# Altium project fMUX_MB.PrjPCB (part 3 of 6)

## Sheet DDR-Memory.SchDoc: FPGA Motherboard for Digital Multiplexed Readout, McGill U.
size B; DocumentNumber: DfMUX12; Revision: Rev0, Prototype; SheetNumber: 12; SheetTotal: 27; PageSetup: Record=PageOptions|CenterHorizontal=True|CenterVertical=True|PrintScale=1.08|XCorrection=1.00|YCorrection=1.00|PrintKind=0|BorderSize=5000000|LeftOffset=0|BottomOffset=0|Orientation=2|PaperLength=1000|PaperWidth=1000|Scale=100|PaperSource=7|PrintQuality=-4|MediaType=1|DitherType=10|PaperKind=Tabloid|PrintScaleMode=1
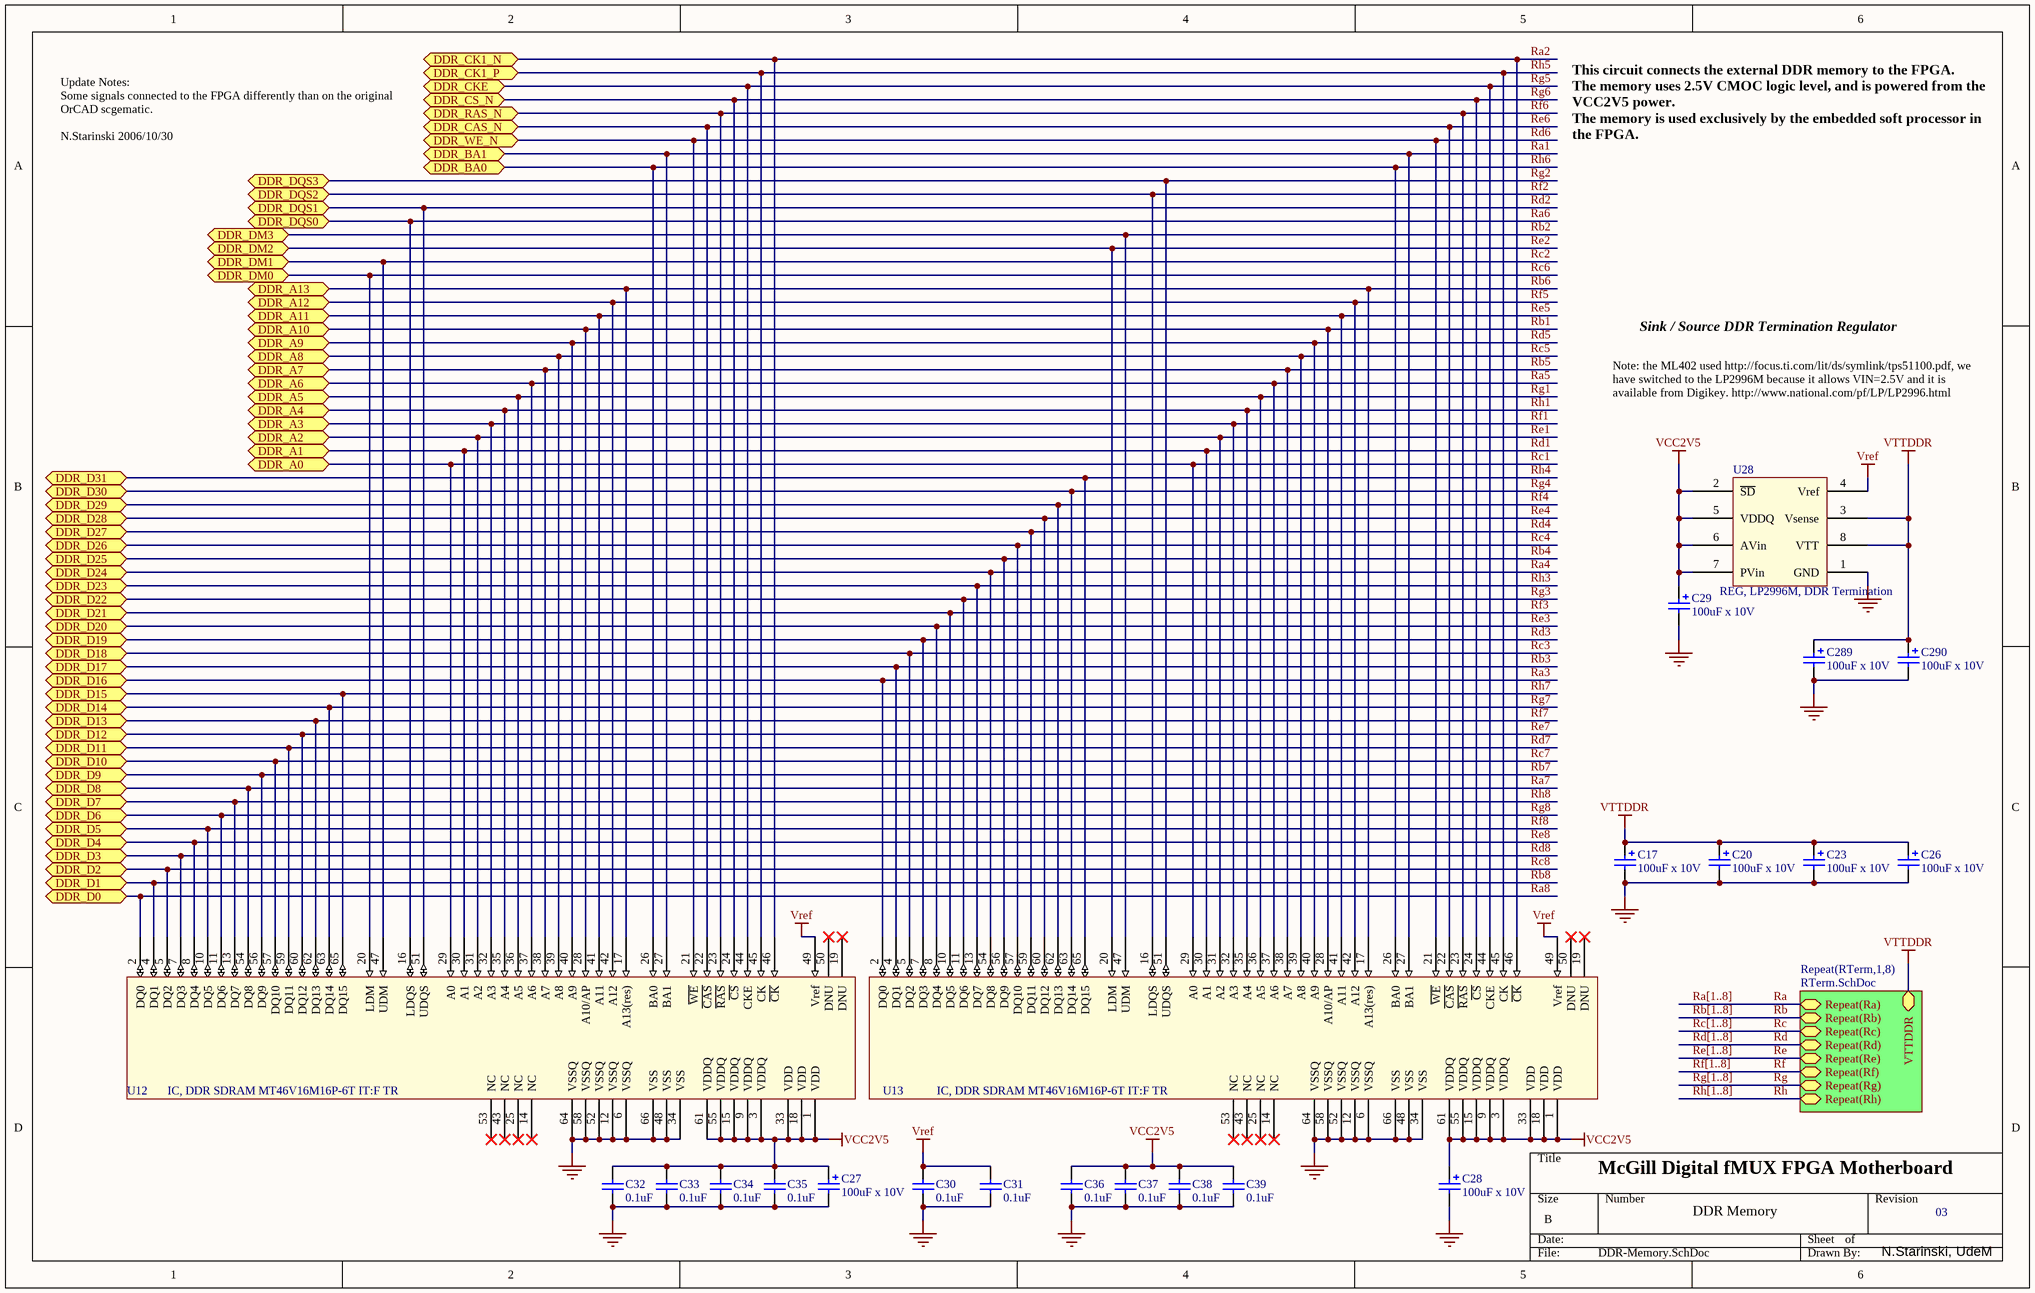
[diagram p13: DDR-Memory.SchDoc]

### Parts
C17  100uF x 10V  [TC6032-2412]
C20  100uF x 10V  [TC6032-2412]
C23  100uF x 10V  [TC6032-2412]
C26  100uF x 10V  [TC6032-2412]
C27  100uF x 10V  [TC6032-2412]
C28  100uF x 10V  [TC6032-2412]
C29  100uF x 10V  [TC6032-2412]
C30  0.1uF  [CC1608-0603]
C31  0.1uF  [CC1608-0603]
C32  0.1uF  [CC1608-0603]
C33  0.1uF  [CC1608-0603]
C34  0.1uF  [CC1608-0603]
C35  0.1uF  [CC1608-0603]
C36  0.1uF  [CC1608-0603]
C37  0.1uF  [CC1608-0603]
C38  0.1uF  [CC1608-0603]
C39  0.1uF  [CC1608-0603]
C289  100uF x 10V  [TC6032-2412]
C290  100uF x 10V  [TC6032-2412]
U12  IC, DDR SDRAM MT46V16M16P-6T IT:F TR  [TSOP-66]
U13  IC, DDR SDRAM MT46V16M16P-6T IT:F TR  [TSOP-66]
U28  REG, LP2996M, DDR Termination  [M08A]

### Sub-sheets
Repeat(RTerm,1,8) = RTerm.SchDoc: Repeat(Ra) (bidir), Repeat(Rb) (bidir), Repeat(Rc) (bidir), Repeat(Rd) (bidir), Repeat(Re) (bidir), Repeat(Rf) (bidir), Repeat(Rg) (bidir), Repeat(Rh) (bidir), VTTDDR (bidir)

### Ports
DDR_A0 (bidir), DDR_A1 (bidir), DDR_A2 (bidir), DDR_A3 (bidir), DDR_A4 (bidir), DDR_A5 (bidir), DDR_A6 (bidir), DDR_A7 (bidir), DDR_A8 (bidir), DDR_A9 (bidir), DDR_A10 (bidir), DDR_A11 (bidir), DDR_A12 (bidir), DDR_A13 (bidir), DDR_BA0 (bidir), DDR_BA1 (bidir), DDR_CAS_N (bidir), DDR_CK1_N (bidir), DDR_CK1_P (bidir), DDR_CKE (bidir), DDR_CS_N (bidir), DDR_D0 (bidir), DDR_D1 (bidir), DDR_D2 (bidir), DDR_D3 (bidir), DDR_D4 (bidir), DDR_D5 (bidir), DDR_D6 (bidir), DDR_D7 (bidir), DDR_D8 (bidir), DDR_D9 (bidir), DDR_D10 (bidir), DDR_D11 (bidir), DDR_D12 (bidir), DDR_D13 (bidir), DDR_D14 (bidir), DDR_D15 (bidir), DDR_D16 (bidir), DDR_D17 (bidir), DDR_D18 (bidir), DDR_D19 (bidir), DDR_D20 (bidir), DDR_D21 (bidir), DDR_D22 (bidir), DDR_D23 (bidir), DDR_D24 (bidir), DDR_D25 (bidir), DDR_D26 (bidir), DDR_D27 (bidir), DDR_D28 (bidir), DDR_D29 (bidir), DDR_D30 (bidir), DDR_D31 (bidir), DDR_DM0 (bidir), DDR_DM1 (bidir), DDR_DM2 (bidir), DDR_DM3 (bidir), DDR_DQS0 (bidir), DDR_DQS1 (bidir), DDR_DQS2 (bidir), DDR_DQS3 (bidir), DDR_RAS_N (bidir), DDR_WE_N (bidir)

### Nets
GND: C17.2 C20.2 C23.2 C26.2 C27.2 C28.2 C29.2 C30.1 C31.1 C32.1 C33.1 C34.1 C35.1 C36.1 C37.1 C38.1 C39.1 C289.2 C290.2 U12.6(VSSQ) U12.12(VSSQ) U12.34(VSS) U12.48(VSS) U12.52(VSSQ) U12.58(VSSQ) U12.64(VSSQ) U12.66(VSS) U13.6(VSSQ) U13.12(VSSQ) U13.34(VSS) U13.48(VSS) U13.52(VSSQ) U13.58(VSSQ) U13.64(VSSQ) U13.66(VSS) U28.1(GND)
VCC2V5: C27.1 C28.1 C29.1 C32.2 C33.2 C34.2 C35.2 C36.2 C37.2 C38.2 C39.2 U12.1(VDD) U12.3(VDDQ) U12.9(VDDQ) U12.15(VDDQ) U12.18(VDD) U12.33(VDD) U12.55(VDDQ) U12.61(VDDQ) U13.1(VDD) U13.3(VDDQ) U13.9(VDDQ) U13.15(VDDQ) U13.18(VDD) U13.33(VDD) U13.55(VDDQ) U13.61(VDDQ) U28.2(~{SD}) U28.5(VDDQ) U28.6(AVin) U28.7(PVin)  [project net Vout2]
Vref: C30.2 C31.2 U12.49(Vref) U13.49(Vref) U28.4(Vref)
VTTDDR: C17.1 C20.1 C23.1 C26.1 C289.1 C290.1 U28.3(Vsense) U28.8(VTT) ; sheet Repeat(RTerm,1,8)/VTTDDR
Ra: sheet Repeat(RTerm,1,8)/Repeat(Ra)
Ra1: U12.27(BA1) U13.27(BA1) ; port DDR_BA1  [project net DDR_BA1]
Ra2: U12.46(~{CK}) U13.46(~{CK}) ; port DDR_CK1_N  [project net DDR_CK1_N]
Ra3: U13.2(DQ0) ; port DDR_D16  [project net DDR_D16]
Ra4: U13.54(DQ8) ; port DDR_D24  [project net DDR_D24]
Ra5: U12.37(A6) U13.37(A6) ; port DDR_A6  [project net DDR_A6]
Ra6: U12.16(LDQS) ; port DDR_DQS0  [project net DDR_DQS0]
Ra7: U12.54(DQ8) ; port DDR_D8  [project net DDR_D8]
Ra8: U12.2(DQ0) ; port DDR_D0  [project net DDR_D0]
Rb: sheet Repeat(RTerm,1,8)/Repeat(Rb)
Rb1: U12.28(A10/AP) U13.28(A10/AP) ; port DDR_A10  [project net DDR_A10]
Rb2: U13.47(UDM) ; port DDR_DM3  [project net DDR_DM3]
Rb3: U13.4(DQ1) ; port DDR_D17  [project net DDR_D17]
Rb4: U13.56(DQ9) ; port DDR_D25  [project net DDR_D25]
Rb5: U12.38(A7) U13.38(A7) ; port DDR_A7  [project net DDR_A7]
Rb6: U12.17(A13(res)) U13.17(A13(res)) ; port DDR_A13  [project net DDR_A13]
Rb7: U12.56(DQ9) ; port DDR_D9  [project net DDR_D9]
Rb8: U12.4(DQ1) ; port DDR_D1  [project net DDR_D1]
Rc: sheet Repeat(RTerm,1,8)/Repeat(Rc)
Rc1: U12.29(A0) U13.29(A0) ; port DDR_A0  [project net DDR_A0]
Rc2: U12.47(UDM) ; port DDR_DM1  [project net DDR_DM1]
Rc3: U13.5(DQ2) ; port DDR_D18  [project net DDR_D18]
Rc4: U13.57(DQ10) ; port DDR_D26  [project net DDR_D26]
Rc5: U12.39(A8) U13.39(A8) ; port DDR_A8  [project net DDR_A8]
Rc6: U12.20(LDM) ; port DDR_DM0  [project net DDR_DM0]
Rc7: U12.57(DQ10) ; port DDR_D10  [project net DDR_D10]
Rc8: U12.5(DQ2) ; port DDR_D2  [project net DDR_D2]
Rd: sheet Repeat(RTerm,1,8)/Repeat(Rd)
Rd1: U12.30(A1) U13.30(A1) ; port DDR_A1  [project net DDR_A1]
Rd2: U12.51(UDQS) ; port DDR_DQS1  [project net DDR_DQS1]
Rd3: U13.7(DQ3) ; port DDR_D19  [project net DDR_D19]
Rd4: U13.59(DQ11) ; port DDR_D27  [project net DDR_D27]
Rd5: U12.40(A9) U13.40(A9) ; port DDR_A9  [project net DDR_A9]
Rd6: U12.21(~{WE}) U13.21(~{WE}) ; port DDR_WE_N  [project net DDR_WE_N]
Rd7: U12.59(DQ11) ; port DDR_D11  [project net DDR_D11]
Rd8: U12.7(DQ3) ; port DDR_D3  [project net DDR_D3]
Re: sheet Repeat(RTerm,1,8)/Repeat(Re)
Re1: U12.31(A2) U13.31(A2) ; port DDR_A2  [project net DDR_A2]
Re2: U13.20(LDM) ; port DDR_DM2  [project net DDR_DM2]
Re3: U13.8(DQ4) ; port DDR_D20  [project net DDR_D20]
Re4: U13.60(DQ12) ; port DDR_D28  [project net DDR_D28]
Re5: U12.41(A11) U13.41(A11) ; port DDR_A11  [project net DDR_A11]
Re6: U12.22(~{CAS}) U13.22(~{CAS}) ; port DDR_CAS_N  [project net DDR_CAS_N]
Re7: U12.60(DQ12) ; port DDR_D12  [project net DDR_D12]
Re8: U12.8(DQ4) ; port DDR_D4  [project net DDR_D4]
Rf: sheet Repeat(RTerm,1,8)/Repeat(Rf)
Rf1: U12.32(A3) U13.32(A3) ; port DDR_A3  [project net DDR_A3]
Rf2: U13.16(LDQS) ; port DDR_DQS2  [project net DDR_DQS2]
Rf3: U13.10(DQ5) ; port DDR_D21  [project net DDR_D21]
Rf4: U13.62(DQ13) ; port DDR_D29  [project net DDR_D29]
Rf5: U12.42(A12) U13.42(A12) ; port DDR_A12  [project net DDR_A12]
Rf6: U12.23(~{RAS}) U13.23(~{RAS}) ; port DDR_RAS_N  [project net DDR_RAS_N]
Rf7: U12.62(DQ13) ; port DDR_D13  [project net DDR_D13]
Rf8: U12.10(DQ5) ; port DDR_D5  [project net DDR_D5]
Rg: sheet Repeat(RTerm,1,8)/Repeat(Rg)
Rg1: U12.36(A5) U13.36(A5) ; port DDR_A5  [project net DDR_A5]
Rg2: U13.51(UDQS) ; port DDR_DQS3  [project net DDR_DQS3]
Rg3: U13.11(DQ6) ; port DDR_D22  [project net DDR_D22]
Rg4: U13.63(DQ14) ; port DDR_D30  [project net DDR_D30]
Rg5: U12.44(CKE) U13.44(CKE) ; port DDR_CKE  [project net DDR_CKE]
Rg6: U12.24(~{CS}) U13.24(~{CS}) ; port DDR_CS_N  [project net DDR_CS_N]
Rg7: U12.63(DQ14) ; port DDR_D14  [project net DDR_D14]
Rg8: U12.11(DQ6) ; port DDR_D6  [project net DDR_D6]
Rh: sheet Repeat(RTerm,1,8)/Repeat(Rh)
Rh1: U12.35(A4) U13.35(A4) ; port DDR_A4  [project net DDR_A4]
Rh3: U13.13(DQ7) ; port DDR_D23  [project net DDR_D23]
Rh4: U13.65(DQ15) ; port DDR_D31  [project net DDR_D31]
Rh5: U12.45(CK) U13.45(CK) ; port DDR_CK1_P  [project net DDR_CK1_P]
Rh6: U12.26(BA0) U13.26(BA0) ; port DDR_BA0  [project net DDR_BA0]
Rh7: U12.65(DQ15) ; port DDR_D15  [project net DDR_D15]
Rh8: U12.13(DQ7) ; port DDR_D7  [project net DDR_D7]

Not connected (* = marked no-connect by the designer): U12 14(NC)* 19(DNU)* 25(NC)* 43(NC)* 50(DNU)* 53(NC)*; U13 14(NC)* 19(DNU)* 25(NC)* 43(NC)* 50(DNU)* 53(NC)*

### Buses and harness runs
bus Ra[1..8]
bus Rb[1..8]
bus Rc[1..8]
bus Rd[1..8]
bus Re[1..8]
bus Rf[1..8]
bus Rg[1..8]
bus Rh[1..8]

### Notes on the sheet
- Update Notes:
  Some signals connected to the FPGA differently than on the original OrCAD scgematic.
  N.Starinski 2006/10/30
- This circuit connects the external DDR memory to the FPGA.
  The memory uses 2.5V CMOC logic level, and is powered from the VCC2V5 power.
  The memory is used exclusively by the embedded soft processor in the FPGA.
- Sink / Source DDR Termination Regulator
- Note: the ML402 used http://focus.ti.com/lit/ds/symlink/tps51100.pdf, we have switched to the LP2996M because it allows VIN=2.5V and it is available from Digikey. http://www.national.com/pf/LP/LP2996.html
- McGill Digital fMUX FPGA Motherboard
- DDR Memory
- 03
- N.Starinski, UdeM

### Library data of the parts
C17 C20 C23 C26-C29 C289 C290 = Cap Pol3: CAP TANTC TPSC107K010R0075; Published: 8-Jun-2000; LatestRevisionDate: 17-Jul-2002; LatestRevisionNote: Re-released for DXP Platform.; PackageReference: C0805; Publisher: Altium Limited
C30-C39 = Cap Semi: Capacitor (Semiconductor SIM Model); Published: 8-Jun-2000; LatestRevisionDate: 17-Jul-2002; LatestRevisionNote: Re-released for DXP Platform.; PackageReference: C1206; Publisher: Altium Limited
U12 U13 = MT46V16M16: 256Mb, 4Meg X 16 X 4 banks DDR SDRAM
U28 = LP2996: DDR Termination Regulator

## Sheet RTerm.SchDoc: FPGA Motherboard for Digital Multiplexed Readout, McGill U.
size Letter; DocumentNumber: DfMUX13; Revision: Rev0, Prototype; SheetNumber: 13; SheetTotal: 27; PageSetup: Record=PageOptions|CenterHorizontal=True|CenterVertical=True|PrintScale=0.93|XCorrection=1.00|YCorrection=1.00|PrintKind=0|BorderSize=5000000|LeftOffset=0|BottomOffset=0|Orientation=2|PaperLength=1000|PaperWidth=1000|Scale=100|PaperSource=7|PrintQuality=-4|MediaType=1|DitherType=10|PaperKind=Letter|PrintScaleMode=1
Used 8 times, as channels U_DDR-Memory/RTerm1, U_DDR-Memory/RTerm2, U_DDR-Memory/RTerm3, U_DDR-Memory/RTerm4, U_DDR-Memory/RTerm5, U_DDR-Memory/RTerm6, U_DDR-Memory/RTerm7, U_DDR-Memory/RTerm8. Parts and nets are listed once, with the designators drawn on the sheet.
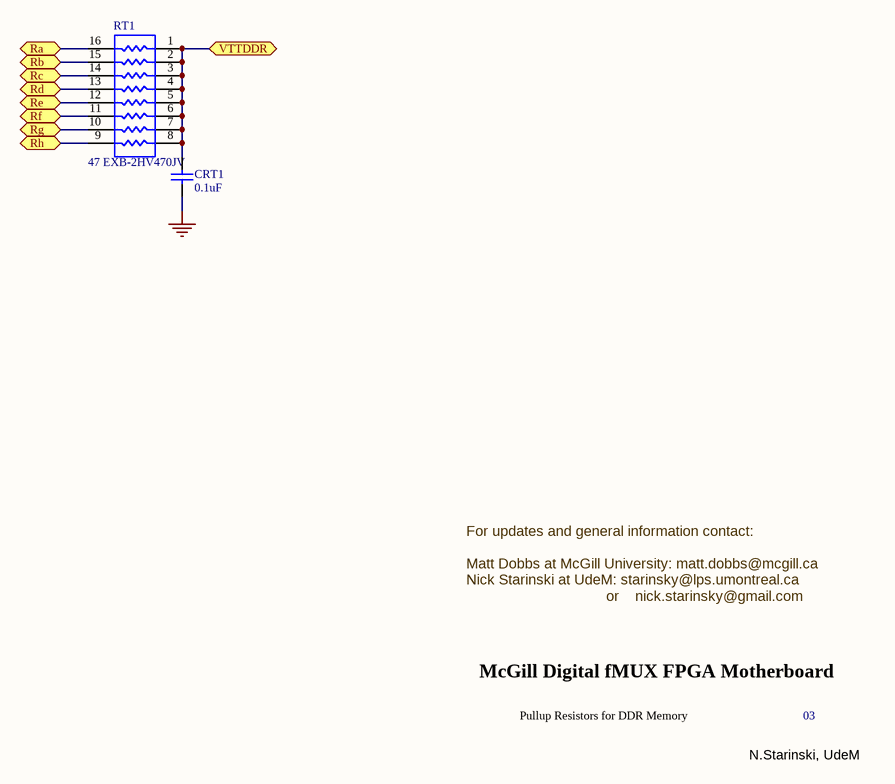
[diagram p14: RTerm.SchDoc]

### Parts
CRT1  0.1uF  [CC1608-0603]
RT1  47 EXB-2HV470JV  [0402_Array_2HV]

### Ports
Ra (bidir), Rb (bidir), Rc (bidir), Rd (bidir), Re (bidir), Rf (bidir), Rg (bidir), Rh (bidir), VTTDDR (bidir)

### Nets
GND: CRT1.1
Ra: RT1.16 ; port Ra
Rb: RT1.15 ; port Rb
Rc: RT1.14 ; port Rc
Rd: RT1.13 ; port Rd
Re: RT1.12 ; port Re
Rf: RT1.11 ; port Rf
Rg: RT1.10 ; port Rg
Rh: RT1.9 ; port Rh
VTTDDR: CRT1.2 RT1.1 RT1.2 RT1.3 RT1.4 RT1.5 RT1.6 RT1.7 RT1.8 ; port VTTDDR

### Channels
U_DDR-Memory/RTerm1: designators end in _1; ports Ra=DDR_BA1 Rb=DDR_A10 Rc=DDR_A0 Rd=DDR_A1 Re=DDR_A2 Rf=DDR_A3 Rg=DDR_A5 Rh=DDR_A4 VTTDDR=VTTDDR
U_DDR-Memory/RTerm2: designators end in _2; ports Ra=DDR_CK1_N Rb=DDR_DM3 Rc=DDR_DM1 Rd=DDR_DQS1 Re=DDR_DM2 Rf=DDR_DQS2 Rg=DDR_DQS3 Rh=Rh2 VTTDDR=VTTDDR
U_DDR-Memory/RTerm3: designators end in _3; ports Ra=DDR_D16 Rb=DDR_D17 Rc=DDR_D18 Rd=DDR_D19 Re=DDR_D20 Rf=DDR_D21 Rg=DDR_D22 Rh=DDR_D23 VTTDDR=VTTDDR
U_DDR-Memory/RTerm4: designators end in _4; ports Ra=DDR_D24 Rb=DDR_D25 Rc=DDR_D26 Rd=DDR_D27 Re=DDR_D28 Rf=DDR_D29 Rg=DDR_D30 Rh=DDR_D31 VTTDDR=VTTDDR
U_DDR-Memory/RTerm5: designators end in _5; ports Ra=DDR_A6 Rb=DDR_A7 Rc=DDR_A8 Rd=DDR_A9 Re=DDR_A11 Rf=DDR_A12 Rg=DDR_CKE Rh=DDR_CK1_P VTTDDR=VTTDDR
U_DDR-Memory/RTerm6: designators end in _6; ports Ra=DDR_DQS0 Rb=DDR_A13 Rc=DDR_DM0 Rd=DDR_WE_N Re=DDR_CAS_N Rf=DDR_RAS_N Rg=DDR_CS_N Rh=DDR_BA0 VTTDDR=VTTDDR
U_DDR-Memory/RTerm7: designators end in _7; ports Ra=DDR_D8 Rb=DDR_D9 Rc=DDR_D10 Rd=DDR_D11 Re=DDR_D12 Rf=DDR_D13 Rg=DDR_D14 Rh=DDR_D15 VTTDDR=VTTDDR
U_DDR-Memory/RTerm8: designators end in _8; ports Ra=DDR_D0 Rb=DDR_D1 Rc=DDR_D2 Rd=DDR_D3 Re=DDR_D4 Rf=DDR_D5 Rg=DDR_D6 Rh=DDR_D7 VTTDDR=VTTDDR

### Notes on the sheet
- For updates and general information contact:
  Matt Dobbs at McGill University: matt.dobbs@mcgill.ca
  Nick Starinski at UdeM: starinsky@lps.umontreal.ca
  or    nick.starinsky@gmail.com
- McGill Digital fMUX FPGA Motherboard
- Pullup Resistors for DDR Memory
- 03
- N.Starinski, UdeM

### Library data of the parts
CRT1 = Cap Semi: Capacitor (Semiconductor SIM Model); Published: 8-Jun-2000; LatestRevisionDate: 17-Jul-2002; LatestRevisionNote: Re-released for DXP Platform.; PackageReference: C1206; Publisher: Altium Limited
RT1 = Res Pack3: Isolated Resistor Network; Published: 24-Mar-1999; LatestRevisionDate: 17-Jul-2002; LatestRevisionNote: Re-released for DXP Platform.; Publisher: Altium Limited

## Sheet Eurocard VME 6U P1.schdoc: FPGA Motherboard for Digital Multiplexed Readout, McGill U.
size B; DocumentNumber: DfMUX24; Revision: Rev0, Prototype; SheetNumber: 24; SheetTotal: 27; PageSetup: Record=PageOptions|CenterHorizontal=True|CenterVertical=True|PrintScale=1.08|XCorrection=1.00|YCorrection=1.00|PrintKind=0|BorderSize=5000000|LeftOffset=0|BottomOffset=0|Orientation=2|PaperLength=1000|PaperWidth=1000|Scale=100|PaperSource=7|PrintQuality=-4|MediaType=1|DitherType=10|PaperKind=Tabloid|PrintScaleMode=1
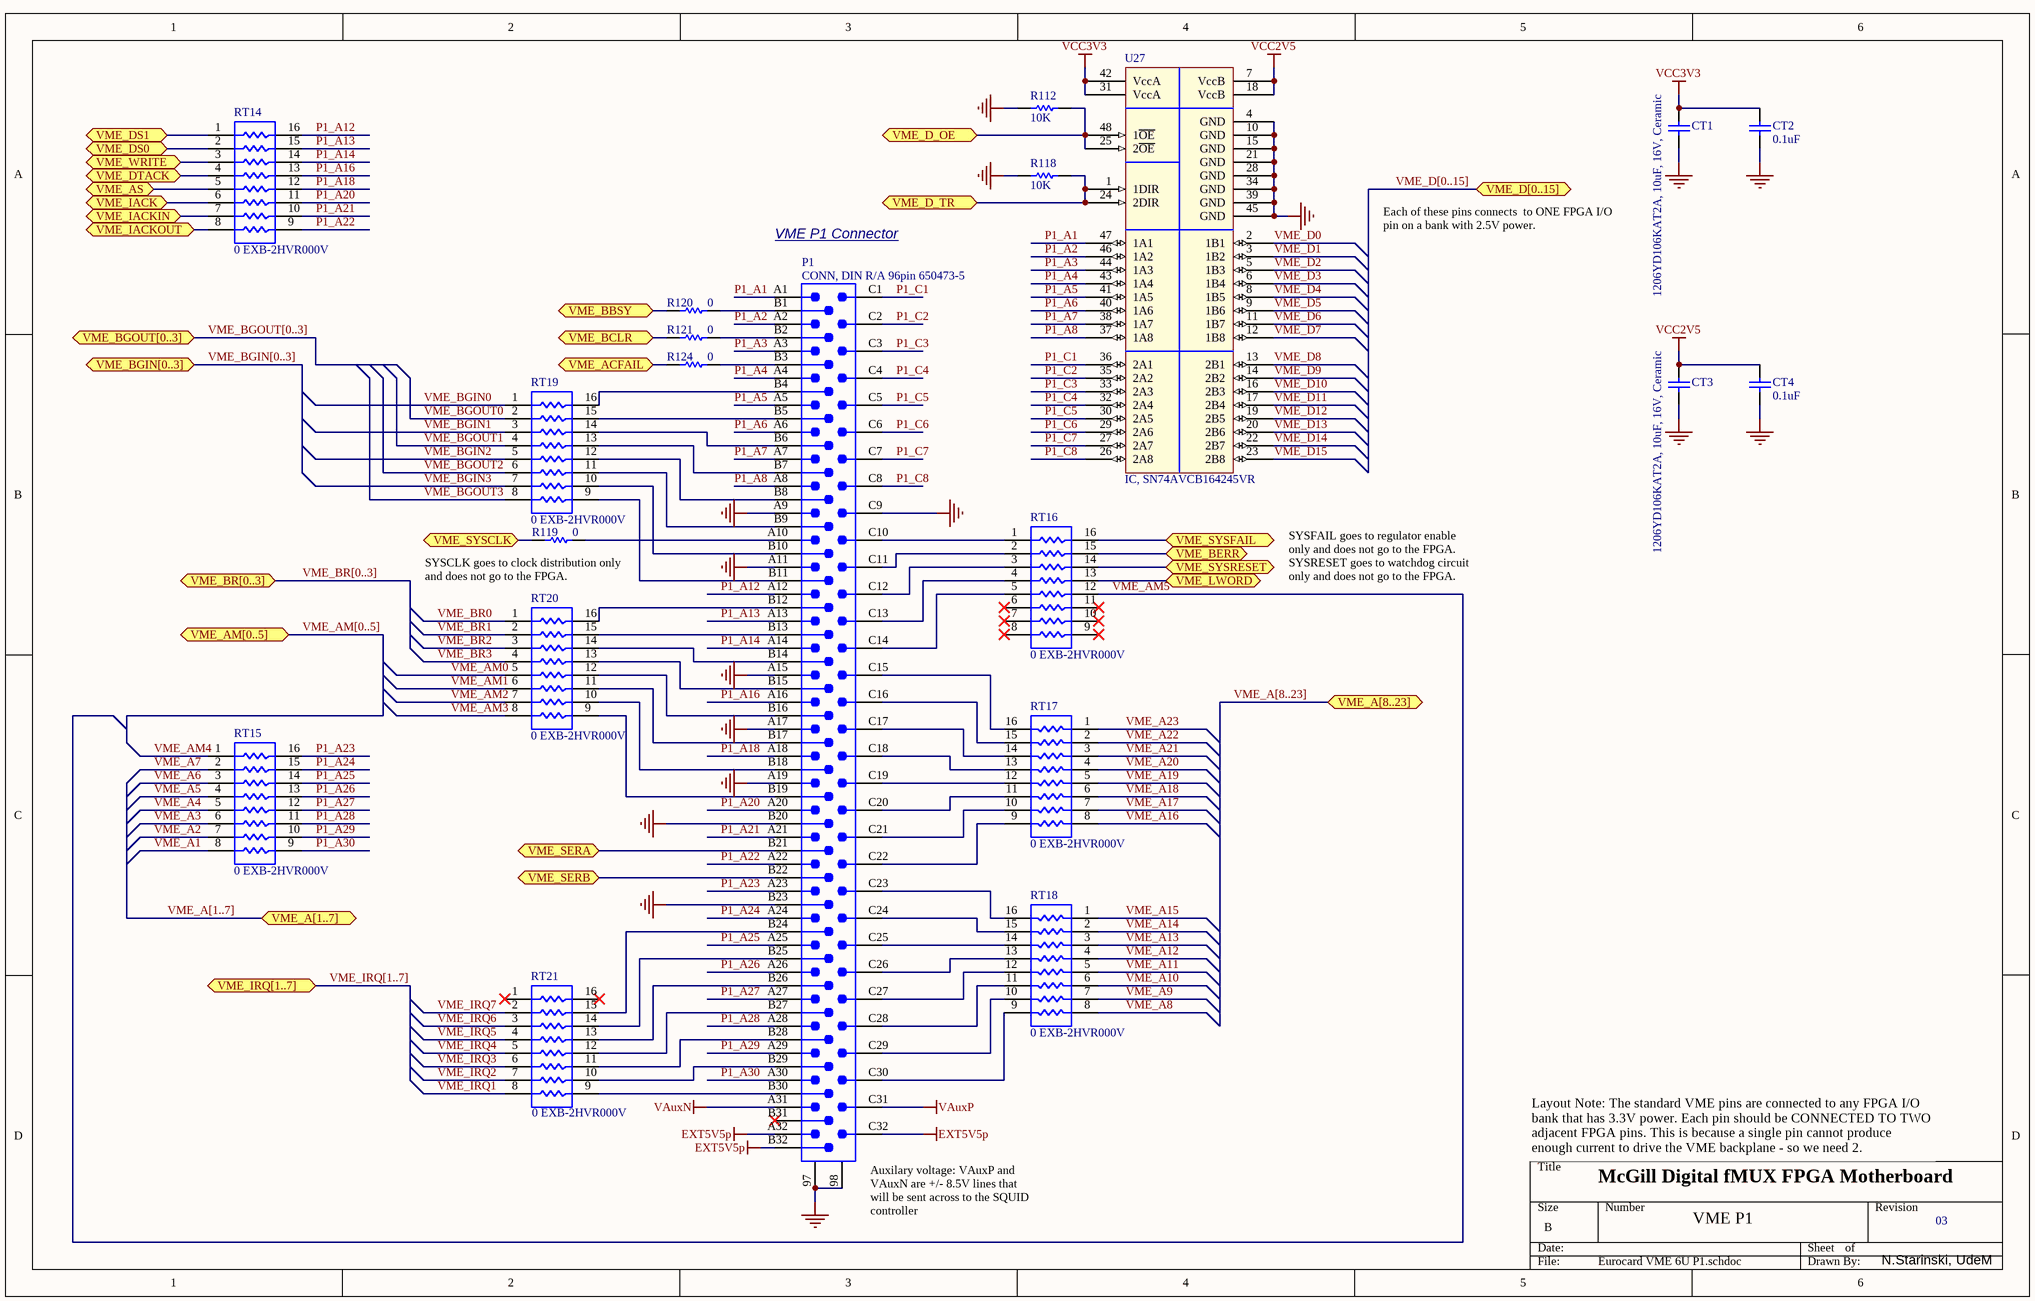
[diagram p15: Eurocard VME 6U P1.schdoc]

### Parts
CT1  1206YD106KAT2A, 10uF, 16V, Ceramic  [CC3225-1210]
CT2  0.1uF  [CC1608-0603]
CT3  1206YD106KAT2A, 10uF, 16V, Ceramic  [CC3225-1210]
CT4  0.1uF  [CC1608-0603]
P1  CONN, DIN R/A 96pin 650473-5  [CNVME96]
R112  10K  [CR1608-0603]
R118  10K  [CR1608-0603]
R119  0  [CR1608-0603]
R120  0  [CR1608-0603]
R121  0  [CR1608-0603]
R124  0  [CR1608-0603]
RT14  0 EXB-2HVR000V  [0402_Array_2HV]
RT15  0 EXB-2HVR000V  [0402_Array_2HV]
RT16  0 EXB-2HVR000V  [0402_Array_2HV]
RT17  0 EXB-2HVR000V  [0402_Array_2HV]
RT18  0 EXB-2HVR000V  [0402_Array_2HV]
RT19  0 EXB-2HVR000V  [0402_Array_2HV]
RT20  0 EXB-2HVR000V  [0402_Array_2HV]
RT21  0 EXB-2HVR000V  [0402_Array_2HV]
U27  IC, SN74AVCB164245VR  [DGV048]

### Ports
VME_A[1..7] (bidir), VME_A[8..23] (bidir), VME_ACFAIL (bidir), VME_AM[0..5] (bidir), VME_AS (bidir), VME_BBSY (bidir), VME_BCLR (bidir), VME_BERR (bidir), VME_BGIN[0..3] (bidir), VME_BGOUT[0..3] (bidir), VME_BR[0..3] (bidir), VME_D[0..15] (bidir), VME_D_OE (bidir), VME_D_TR (bidir), VME_DS0 (bidir), VME_DS1 (bidir), VME_DTACK (bidir), VME_IACK (bidir), VME_IACKIN (bidir), VME_IACKOUT (bidir), VME_IRQ[1..7] (bidir), VME_LWORD (bidir), VME_SERA (bidir), VME_SERB (bidir), VME_SYSCLK (bidir), VME_SYSFAIL (bidir), VME_SYSRESET (bidir), VME_WRITE (bidir)

### Nets
EXT5V5p: P1.A32 P1.B32 P1.C32
GND: CT1.2 CT2.2 CT3.2 CT4.2 P1.97 P1.98 P1.A9 P1.A11 P1.A15 P1.A17 P1.A19 P1.B20 P1.B23 P1.C9 R112.1 R118.1 U27.4(GND) U27.10(GND) U27.15(GND) U27.21(GND) U27.28(GND) U27.34(GND) U27.39(GND) U27.45(GND)
VAuxN: P1.A31
VAuxP: P1.C31
VCC2V5: CT3.1 CT4.1 U27.7(VccB) U27.18(VccB)  [project net Vout2]
VCC3V3: CT1.1 CT2.1 U27.31(VccA) U27.42(VccA)
P1_A1: P1.A1 U27.47(1A1)  [project net P1_A1_24]
P1_A2: P1.A2 U27.46(1A2)  [project net P1_A2_24]
P1_A3: P1.A3 U27.44(1A3)  [project net P1_A3_24]
P1_A4: P1.A4 U27.43(1A4)  [project net P1_A4_24]
P1_A5: P1.A5 U27.41(1A5)  [project net P1_A5_24]
P1_A6: P1.A6 U27.40(1A6)  [project net P1_A6_24]
P1_A7: P1.A7 U27.38(1A7)  [project net P1_A7_24]
P1_A8: P1.A8 U27.37(1A8)  [project net P1_A8_24]
P1_A12: P1.A12 RT14.16  [project net P1_A12_24]
P1_A13: P1.A13 RT14.15  [project net P1_A13_24]
P1_A14: P1.A14 RT14.14  [project net P1_A14_24]
P1_A16: P1.A16 RT14.13  [project net P1_A16_24]
P1_A18: P1.A18 RT14.12  [project net P1_A18_24]
P1_A20: P1.A20 RT14.11  [project net P1_A20_24]
P1_A21: P1.A21 RT14.10  [project net P1_A21_24]
P1_A22: P1.A22 RT14.9  [project net P1_A22_24]
P1_A23: P1.A23 RT15.16  [project net P1_A23_24]
P1_A24: P1.A24 RT15.15  [project net P1_A24_24]
P1_A25: P1.A25 RT15.14  [project net P1_A25_24]
P1_A26: P1.A26 RT15.13  [project net P1_A26_24]
P1_A27: P1.A27 RT15.12  [project net P1_A27_24]
P1_A28: P1.A28 RT15.11  [project net P1_A28_24]
P1_A29: P1.A29 RT15.10  [project net P1_A29_24]
P1_A30: P1.A30 RT15.9  [project net P1_A30_24]
P1_C1: P1.C1 U27.36(2A1)  [project net P1_C1_24]
P1_C2: P1.C2 U27.35(2A2)  [project net P1_C2_24]
P1_C3: P1.C3 U27.33(2A3)  [project net P1_C3_24]
P1_C4: P1.C4 U27.32(2A4)  [project net P1_C4_24]
P1_C5: P1.C5 U27.30(2A5)  [project net P1_C5_24]
P1_C6: P1.C6 U27.29(2A6)  [project net P1_C6_24]
P1_C7: P1.C7 U27.27(2A7)  [project net P1_C7_24]
P1_C8: P1.C8 U27.26(2A8)  [project net P1_C8_24]
VME_A1: RT15.8
VME_A2: RT15.7
VME_A3: RT15.6
VME_A4: RT15.5
VME_A5: RT15.4
VME_A6: RT15.3
VME_A7: RT15.2
VME_A8: RT18.8
VME_A9: RT18.7
VME_A10: RT18.6
VME_A11: RT18.5
VME_A12: RT18.4
VME_A13: RT18.3
VME_A14: RT18.2
VME_A15: RT18.1
VME_A16: RT17.8
VME_A17: RT17.7
VME_A18: RT17.6
VME_A19: RT17.5
VME_A20: RT17.4
VME_A21: RT17.3
VME_A22: RT17.2
VME_A23: RT17.1
VME_ACFAIL: R124.1 ; port VME_ACFAIL
VME_AM0: RT20.5
VME_AM1: RT20.6
VME_AM2: RT20.7
VME_AM3: RT20.8
VME_AM4: RT15.1
VME_AM5: RT16.12
VME_AS: RT14.5 ; port VME_AS
VME_BBSY: R120.1 ; port VME_BBSY
VME_BCLR: R121.1 ; port VME_BCLR
VME_BERR: RT16.15 ; port VME_BERR
VME_BGIN0: RT19.1
VME_BGIN1: RT19.3
VME_BGIN2: RT19.5
VME_BGIN3: RT19.7
VME_BGOUT0: RT19.2
VME_BGOUT1: RT19.4
VME_BGOUT2: RT19.6
VME_BGOUT3: RT19.8
VME_BR0: RT20.1
VME_BR1: RT20.2
VME_BR2: RT20.3
VME_BR3: RT20.4
VME_D0: U27.2(1B1)
VME_D1: U27.3(1B2)
VME_D2: U27.5(1B3)
VME_D3: U27.6(1B4)
VME_D4: U27.8(1B5)
VME_D5: U27.9(1B6)
VME_D6: U27.11(1B7)
VME_D7: U27.12(1B8)
VME_D8: U27.13(2B1)
VME_D9: U27.14(2B2)
VME_D10: U27.16(2B3)
VME_D11: U27.17(2B4)
VME_D12: U27.19(2B5)
VME_D13: U27.20(2B6)
VME_D14: U27.22(2B7)
VME_D15: U27.23(2B8)
VME_D_OE: R112.2 U27.25(2~{OE}) U27.48(1~{OE}) ; port VME_D_OE
VME_D_TR: R118.2 U27.1(1DIR) U27.24(2DIR) ; port VME_D_TR
VME_DS0: RT14.2 ; port VME_DS0
VME_DS1: RT14.1 ; port VME_DS1
VME_DTACK: RT14.4 ; port VME_DTACK
VME_IACK: RT14.6 ; port VME_IACK
VME_IACKIN: RT14.7 ; port VME_IACKIN
VME_IACKOUT: RT14.8 ; port VME_IACKOUT
VME_IRQ1: RT21.8
VME_IRQ2: RT21.7
VME_IRQ3: RT21.6
VME_IRQ4: RT21.5
VME_IRQ5: RT21.4
VME_IRQ6: RT21.3
VME_IRQ7: RT21.2
VME_LWORD: RT16.13 ; port VME_LWORD
VME_SERA: P1.B21 ; port VME_SERA
VME_SERB: P1.B22 ; port VME_SERB
VME_SYSCLK: R119.1 ; port VME_SYSCLK
VME_SYSFAIL: RT16.16 ; port VME_SYSFAIL
VME_SYSRESET: RT16.14 ; port VME_SYSRESET
VME_WRITE: RT14.3 ; port VME_WRITE
NetP1_A10: P1.A10 R119.2
NetP1_B1: P1.B1 R120.2
NetP1_B2: P1.B2 R121.2
NetP1_B3: P1.B3 R124.2
NetP1_B4: P1.B4 RT19.16
NetP1_B5: P1.B5 RT19.15
NetP1_B6: P1.B6 RT19.14
NetP1_B7: P1.B7 RT19.13
NetP1_B8: P1.B8 RT19.12
NetP1_B9: P1.B9 RT19.11
NetP1_B10: P1.B10 RT19.10
NetP1_B11: P1.B11 RT19.9
NetP1_B12: P1.B12 RT20.16
NetP1_B13: P1.B13 RT20.15
NetP1_B14: P1.B14 RT20.14
NetP1_B15: P1.B15 RT20.13
NetP1_B16: P1.B16 RT20.12
NetP1_B17: P1.B17 RT20.11
NetP1_B18: P1.B18 RT20.10
NetP1_B19: P1.B19 RT20.9
NetP1_B24: P1.B24 RT21.15
NetP1_B25: P1.B25 RT21.14
NetP1_B26: P1.B26 RT21.13
NetP1_B27: P1.B27 RT21.12
NetP1_B28: P1.B28 RT21.11
NetP1_B29: P1.B29 RT21.10
NetP1_B30: P1.B30 RT21.9
NetP1_C10: P1.C10 RT16.1
NetP1_C11: P1.C11 RT16.2
NetP1_C12: P1.C12 RT16.3
NetP1_C13: P1.C13 RT16.4
NetP1_C14: P1.C14 RT16.5
NetP1_C15: P1.C15 RT17.16
NetP1_C16: P1.C16 RT17.15
NetP1_C17: P1.C17 RT17.14
NetP1_C18: P1.C18 RT17.13
NetP1_C19: P1.C19 RT17.12
NetP1_C20: P1.C20 RT17.11
NetP1_C21: P1.C21 RT17.10
NetP1_C22: P1.C22 RT17.9
NetP1_C23: P1.C23 RT18.16
NetP1_C24: P1.C24 RT18.15
NetP1_C25: P1.C25 RT18.14
NetP1_C26: P1.C26 RT18.13
NetP1_C27: P1.C27 RT18.12
NetP1_C28: P1.C28 RT18.11
NetP1_C29: P1.C29 RT18.10
NetP1_C30: P1.C30 RT18.9

Not connected (* = marked no-connect by the designer): P1 B31*; RT16 6* 7* 8* 9* 10* 11*; RT21 1* 16*

### Buses and harness runs
bus VME_A[1..7] = port VME_A[1..7]
bus VME_A[8..23] = port VME_A[8..23]
bus VME_AM[0..5] = port VME_AM[0..5]
bus VME_BGIN[0..3] = port VME_BGIN[0..3]
bus VME_BGOUT[0..3] = port VME_BGOUT[0..3]
bus VME_BR[0..3] = port VME_BR[0..3]
bus VME_D[0..15] = port VME_D[0..15]
bus VME_IRQ[1..7] = port VME_IRQ[1..7]

### Notes on the sheet
- VME P1 Connector
- Each of these pins connects  to ONE FPGA I/O pin on a bank with 2.5V power.
- (near R119) SYSCLK goes to clock distribution only and does not go to the FPGA.
- SYSFAIL goes to regulator enable only and does not go to the FPGA.
  SYSRESET goes to watchdog circuit only and does not go to the FPGA.
- Layout Note: The standard VME pins are connected to any FPGA I/O bank that has 3.3V power. Each pin should be CONNECTED TO TWO adjacent FPGA pins. This is because a single pin cannot produce enough current to drive the VME backplane - so we need 2.
- McGill Digital fMUX FPGA Motherboard
- (near P1) Auxilary voltage: VAuxP and VAuxN are +/- 8.5V lines that will be sent across to the SQUID controller
- VME P1
- 03
- N.Starinski, UdeM

### Library data of the parts
CT1 CT3 = Cap Semi: CAP POL 1206YD106KAT2A; Published: 8-Jun-2000; LatestRevisionDate: 17-Jul-2002; LatestRevisionNote: Re-released for DXP Platform.; PackageReference: C1206; Publisher: Altium Limited
CT2 CT4 = Cap Semi: Capacitor (Semiconductor SIM Model); Published: 8-Jun-2000; LatestRevisionDate: 17-Jul-2002; LatestRevisionNote: Re-released for DXP Platform.; PackageReference: C1206; Publisher: Altium Limited
P1 = CNVME96: 96-Pin Connector (3x32 2.54mm grid); Text Field6: Alternate Layout Available; Text Field7: Published 14-Feb-2002
R112 R118-R121 R124 = Res Semi: Resistor 0603; Published: 8-Jun-2000; LatestRevisionDate: 17-Jul-2002; LatestRevisionNote: Re-released for DXP Platform.; Publisher: Altium Limited
RT14-RT21 = Res Pack3: Isolated Resistor Network; Published: 24-Mar-1999; LatestRevisionDate: 17-Jul-2002; LatestRevisionNote: Re-released for DXP Platform.; Publisher: Altium Limited
U27 = SN74AVCB164245: 16-Bit Dual-Supply Bus Transceiver with CVT and 3-state

## Sheet Eurocard VME 6U P2.SchDoc: FPGA Motherboard for Digital Multiplexed Readout, McGill U.
size Tabloid; DocumentNumber: DfMUX25; Revision: Rev0, Prototype; SheetNumber: 25; SheetTotal: 27; PageSetup: Record=PageOptions|CenterHorizontal=True|CenterVertical=True|PrintScale=0.95|XCorrection=1.00|YCorrection=1.00|PrintKind=0|BorderSize=5000000|LeftOffset=0|BottomOffset=0|Orientation=2|PaperLength=1000|PaperWidth=1000|Scale=100|PaperSource=7|PrintQuality=-4|MediaType=1|DitherType=10|PaperKind=Tabloid|PrintScaleMode=1
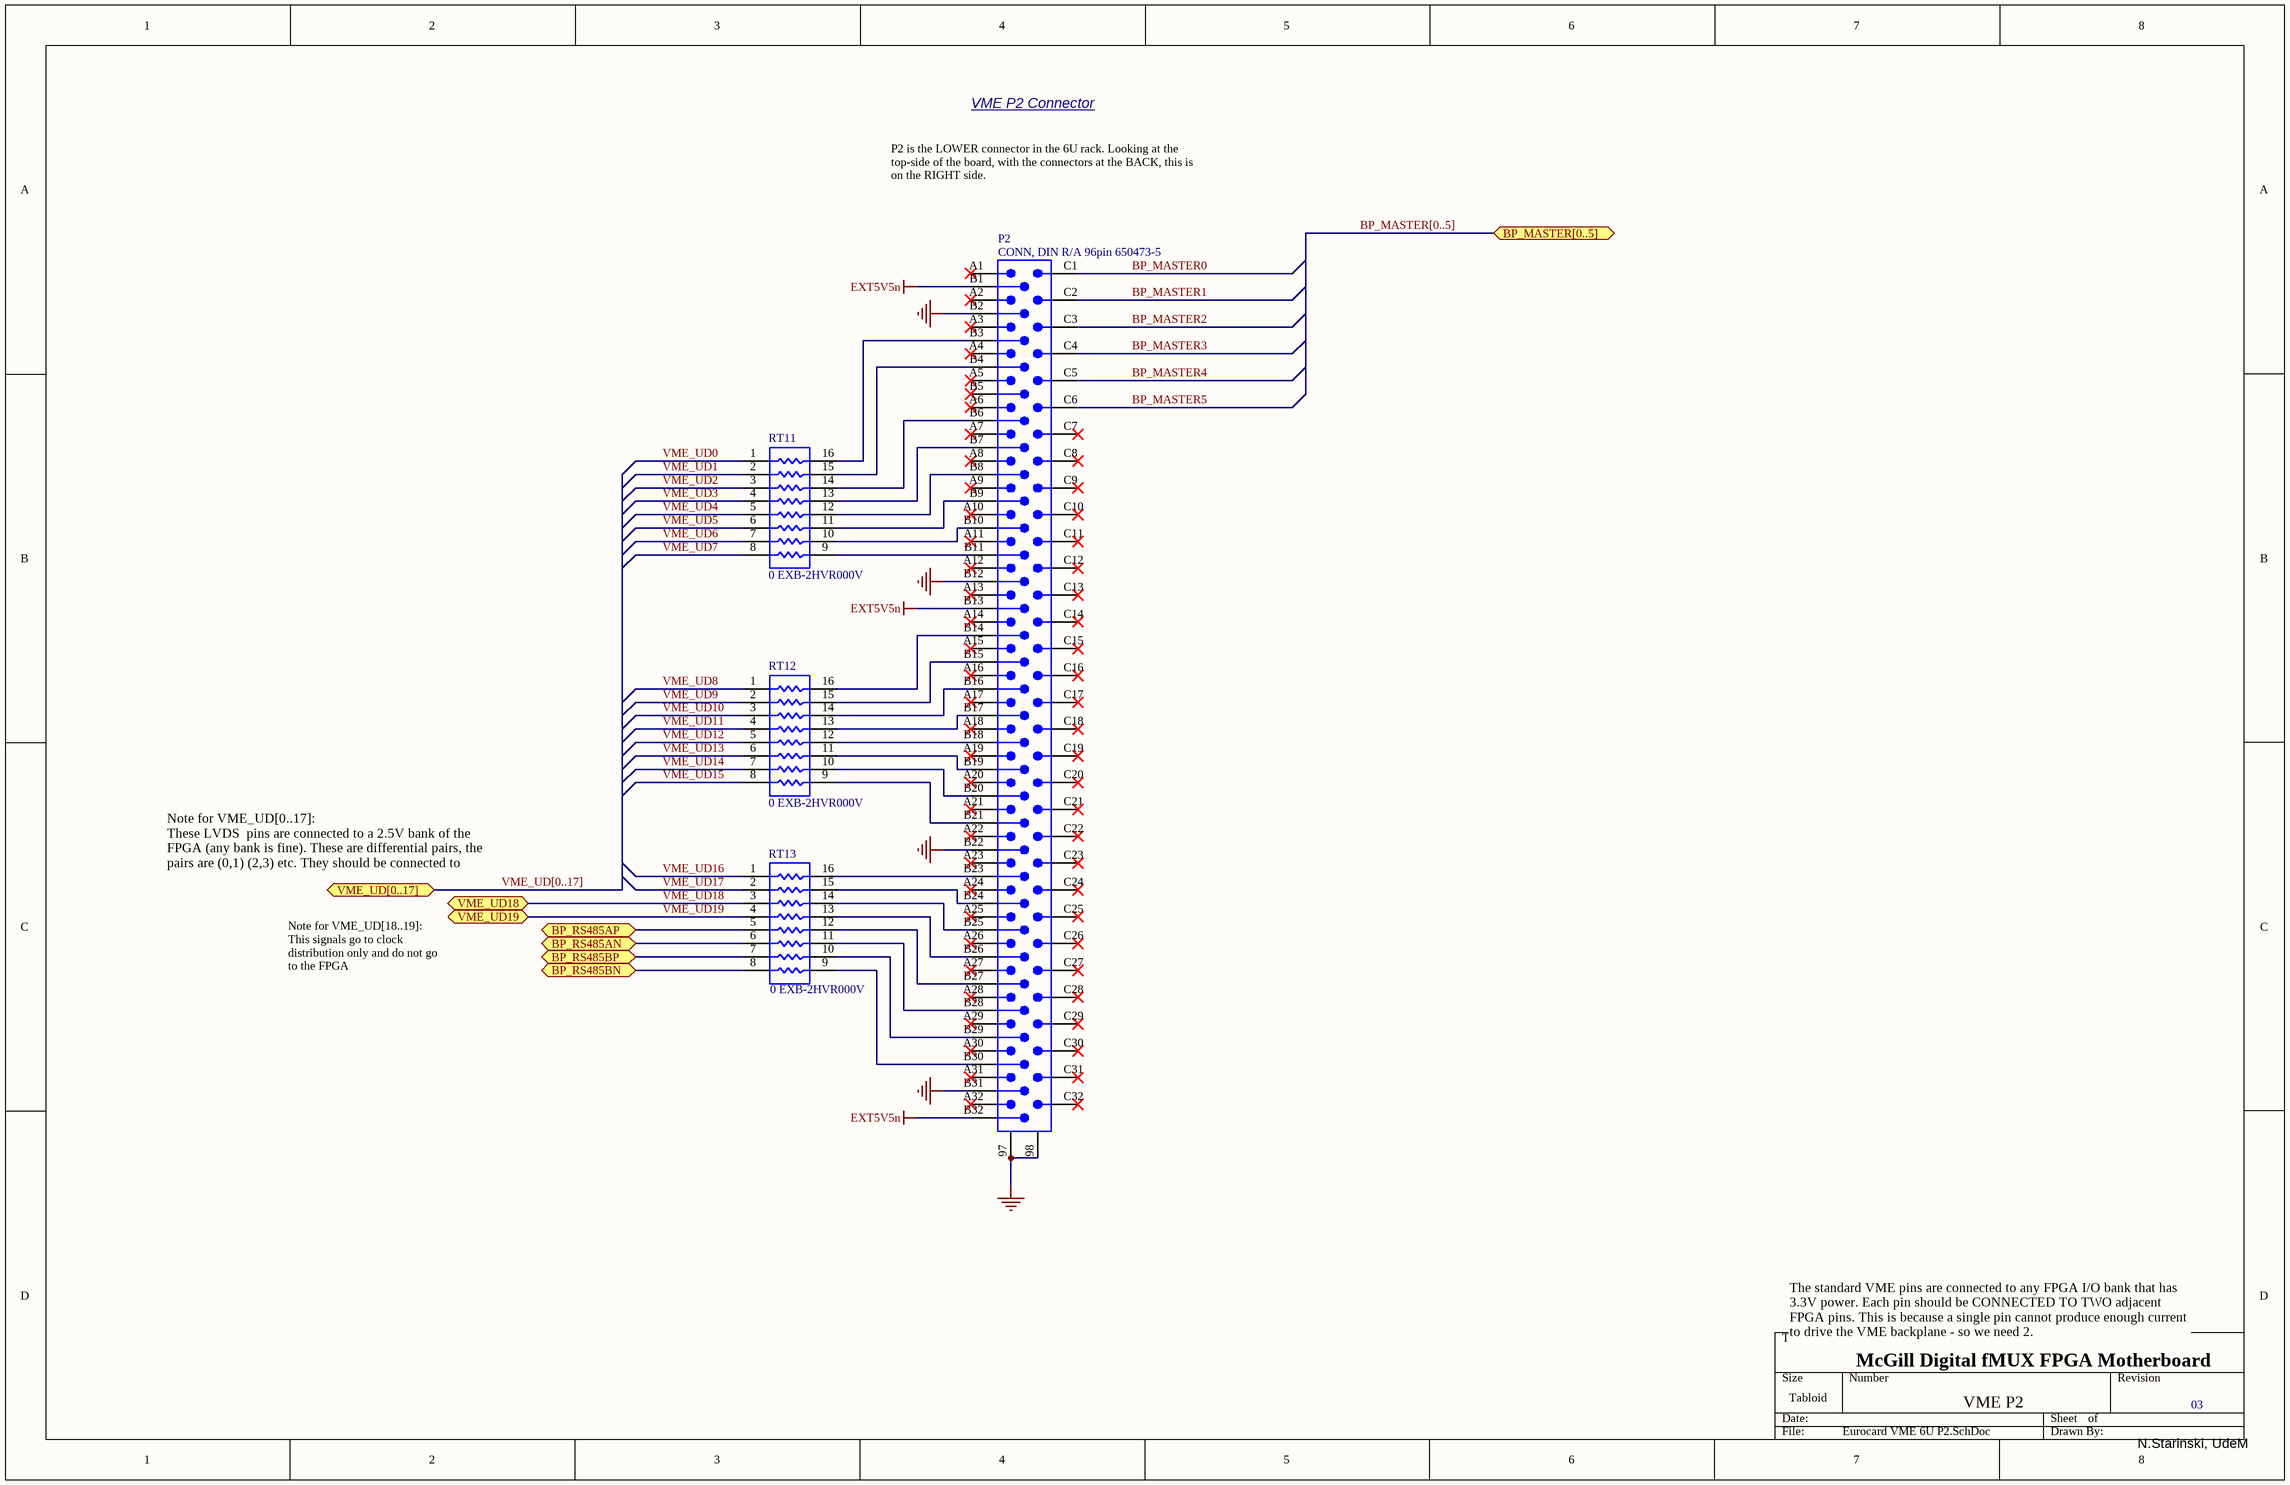
[diagram p16: Eurocard VME 6U P2.SchDoc]

### Parts
P2  CONN, DIN R/A 96pin 650473-5  [CNVME96]
RT11  0 EXB-2HVR000V  [0402_Array_2HV]
RT12  0 EXB-2HVR000V  [0402_Array_2HV]
RT13  0 EXB-2HVR000V  [0402_Array_2HV]

### Ports
BP_MASTER[0..5], BP_RS485AN (bidir), BP_RS485AP (bidir), BP_RS485BN (bidir), BP_RS485BP (bidir), VME_UD18 (bidir), VME_UD19 (bidir), VME_UD[0..17] (bidir)

### Nets
EXT5V5n: P2.B1 P2.B13 P2.B32
GND: P2.97 P2.98 P2.B2 P2.B12 P2.B22 P2.B31
BP_MASTER0: P2.C1
BP_MASTER1: P2.C2
BP_MASTER2: P2.C3
BP_MASTER3: P2.C4
BP_MASTER4: P2.C5
BP_MASTER5: P2.C6
BP_RS485AN: RT13.6 ; port BP_RS485AN
BP_RS485AP: RT13.5 ; port BP_RS485AP
BP_RS485BN: RT13.8 ; port BP_RS485BN
BP_RS485BP: RT13.7 ; port BP_RS485BP
VME_UD0: RT11.1
VME_UD1: RT11.2
VME_UD2: RT11.3
VME_UD3: RT11.4
VME_UD4: RT11.5
VME_UD5: RT11.6
VME_UD6: RT11.7
VME_UD7: RT11.8
VME_UD8: RT12.1
VME_UD9: RT12.2
VME_UD10: RT12.3
VME_UD11: RT12.4
VME_UD12: RT12.5
VME_UD13: RT12.6
VME_UD14: RT12.7
VME_UD15: RT12.8
VME_UD16: RT13.1
VME_UD17: RT13.2
VME_UD18: RT13.3 ; port VME_UD18
VME_UD19: RT13.4 ; port VME_UD19
NetP2_B3: P2.B3 RT11.16
NetP2_B4: P2.B4 RT11.15
NetP2_B6: P2.B6 RT11.14
NetP2_B7: P2.B7 RT11.13
NetP2_B8: P2.B8 RT11.12
NetP2_B9: P2.B9 RT11.11
NetP2_B10: P2.B10 RT11.10
NetP2_B11: P2.B11 RT11.9
NetP2_B14: P2.B14 RT12.16
NetP2_B15: P2.B15 RT12.15
NetP2_B16: P2.B16 RT12.14
NetP2_B17: P2.B17 RT12.13
NetP2_B18: P2.B18 RT12.12
NetP2_B19: P2.B19 RT12.11
NetP2_B20: P2.B20 RT12.10
NetP2_B21: P2.B21 RT12.9
NetP2_B23: P2.B23 RT13.16
NetP2_B24: P2.B24 RT13.15
NetP2_B25: P2.B25 RT13.14
NetP2_B26: P2.B26 RT13.13
NetP2_B27: P2.B27 RT13.12
NetP2_B28: P2.B28 RT13.11
NetP2_B29: P2.B29 RT13.10
NetP2_B30: P2.B30 RT13.9

Not connected (* = marked no-connect by the designer): P2 A1* A2* A3* A4* A5* A6* A7* A8* A9* A10* A11* A12* A13* A14* A15* A16* A17* A18* A19* A20* A21* A22* A23* A24* A25* A26* A27* A28* A29* A30* A31* A32* B5* C7* C8* C9* C10* C11* C12* C13* C14* C15* C16* C17* C18* C19* C20* C21* C22* C23* C24* C25* C26* C27* C28* C29* C30* C31* C32*

### Buses and harness runs
bus BP_MASTER[0..5] = port BP_MASTER[0..5]
bus VME_UD[0..17] = port VME_UD[0..17]

### Notes on the sheet
- VME P2 Connector
- P2 is the LOWER connector in the 6U rack. Looking at the top-side of the board, with the connectors at the BACK, this is on the RIGHT side.
- Note for VME_UD[0..17]:
  These LVDS  pins are connected to a 2.5V bank of the FPGA (any bank is fine). These are differential pairs, the pairs are (0,1) (2,3) etc. They should be connected to pins with P,N.
- Note for VME_UD[18..19]:
  This signals go to clock distribution only and do not go to the FPGA
- The standard VME pins are connected to any FPGA I/O bank that has 3.3V power. Each pin should be CONNECTED TO TWO adjacent FPGA pins. This is because a single pin cannot produce enough current to drive the VME backplane - so we need 2.
- McGill Digital fMUX FPGA Motherboard
- VME P2
- 03
- N.Starinski, UdeM

### Library data of the parts
P2 = CNVME96: as P1 on sheet Eurocard VME 6U P1
RT11-RT13 = Res Pack3: Isolated Resistor Network; Published: 24-Mar-1999; LatestRevisionDate: 17-Jul-2002; LatestRevisionNote: Re-released for DXP Platform.; Publisher: Altium Limited

## Sheet FPGA_Power.SchDoc: FPGA Motherboard for Digital Multiplexed Readout, McGill U.
size Tabloid; DocumentNumber: DfMUX9; Revision: Rev0, Prototype; SheetNumber: 9; SheetTotal: 27; PageSetup: Record=PageOptions|CenterHorizontal=True|CenterVertical=True|PrintScale=0.95|XCorrection=1.00|YCorrection=1.00|PrintKind=0|BorderSize=5000000|LeftOffset=0|BottomOffset=0|Orientation=2|PaperLength=1000|PaperWidth=1000|Scale=100|PaperSource=15|PrintQuality=300|MediaType=1|DitherType=10|PaperKind=Tabloid|PrintScaleMode=1
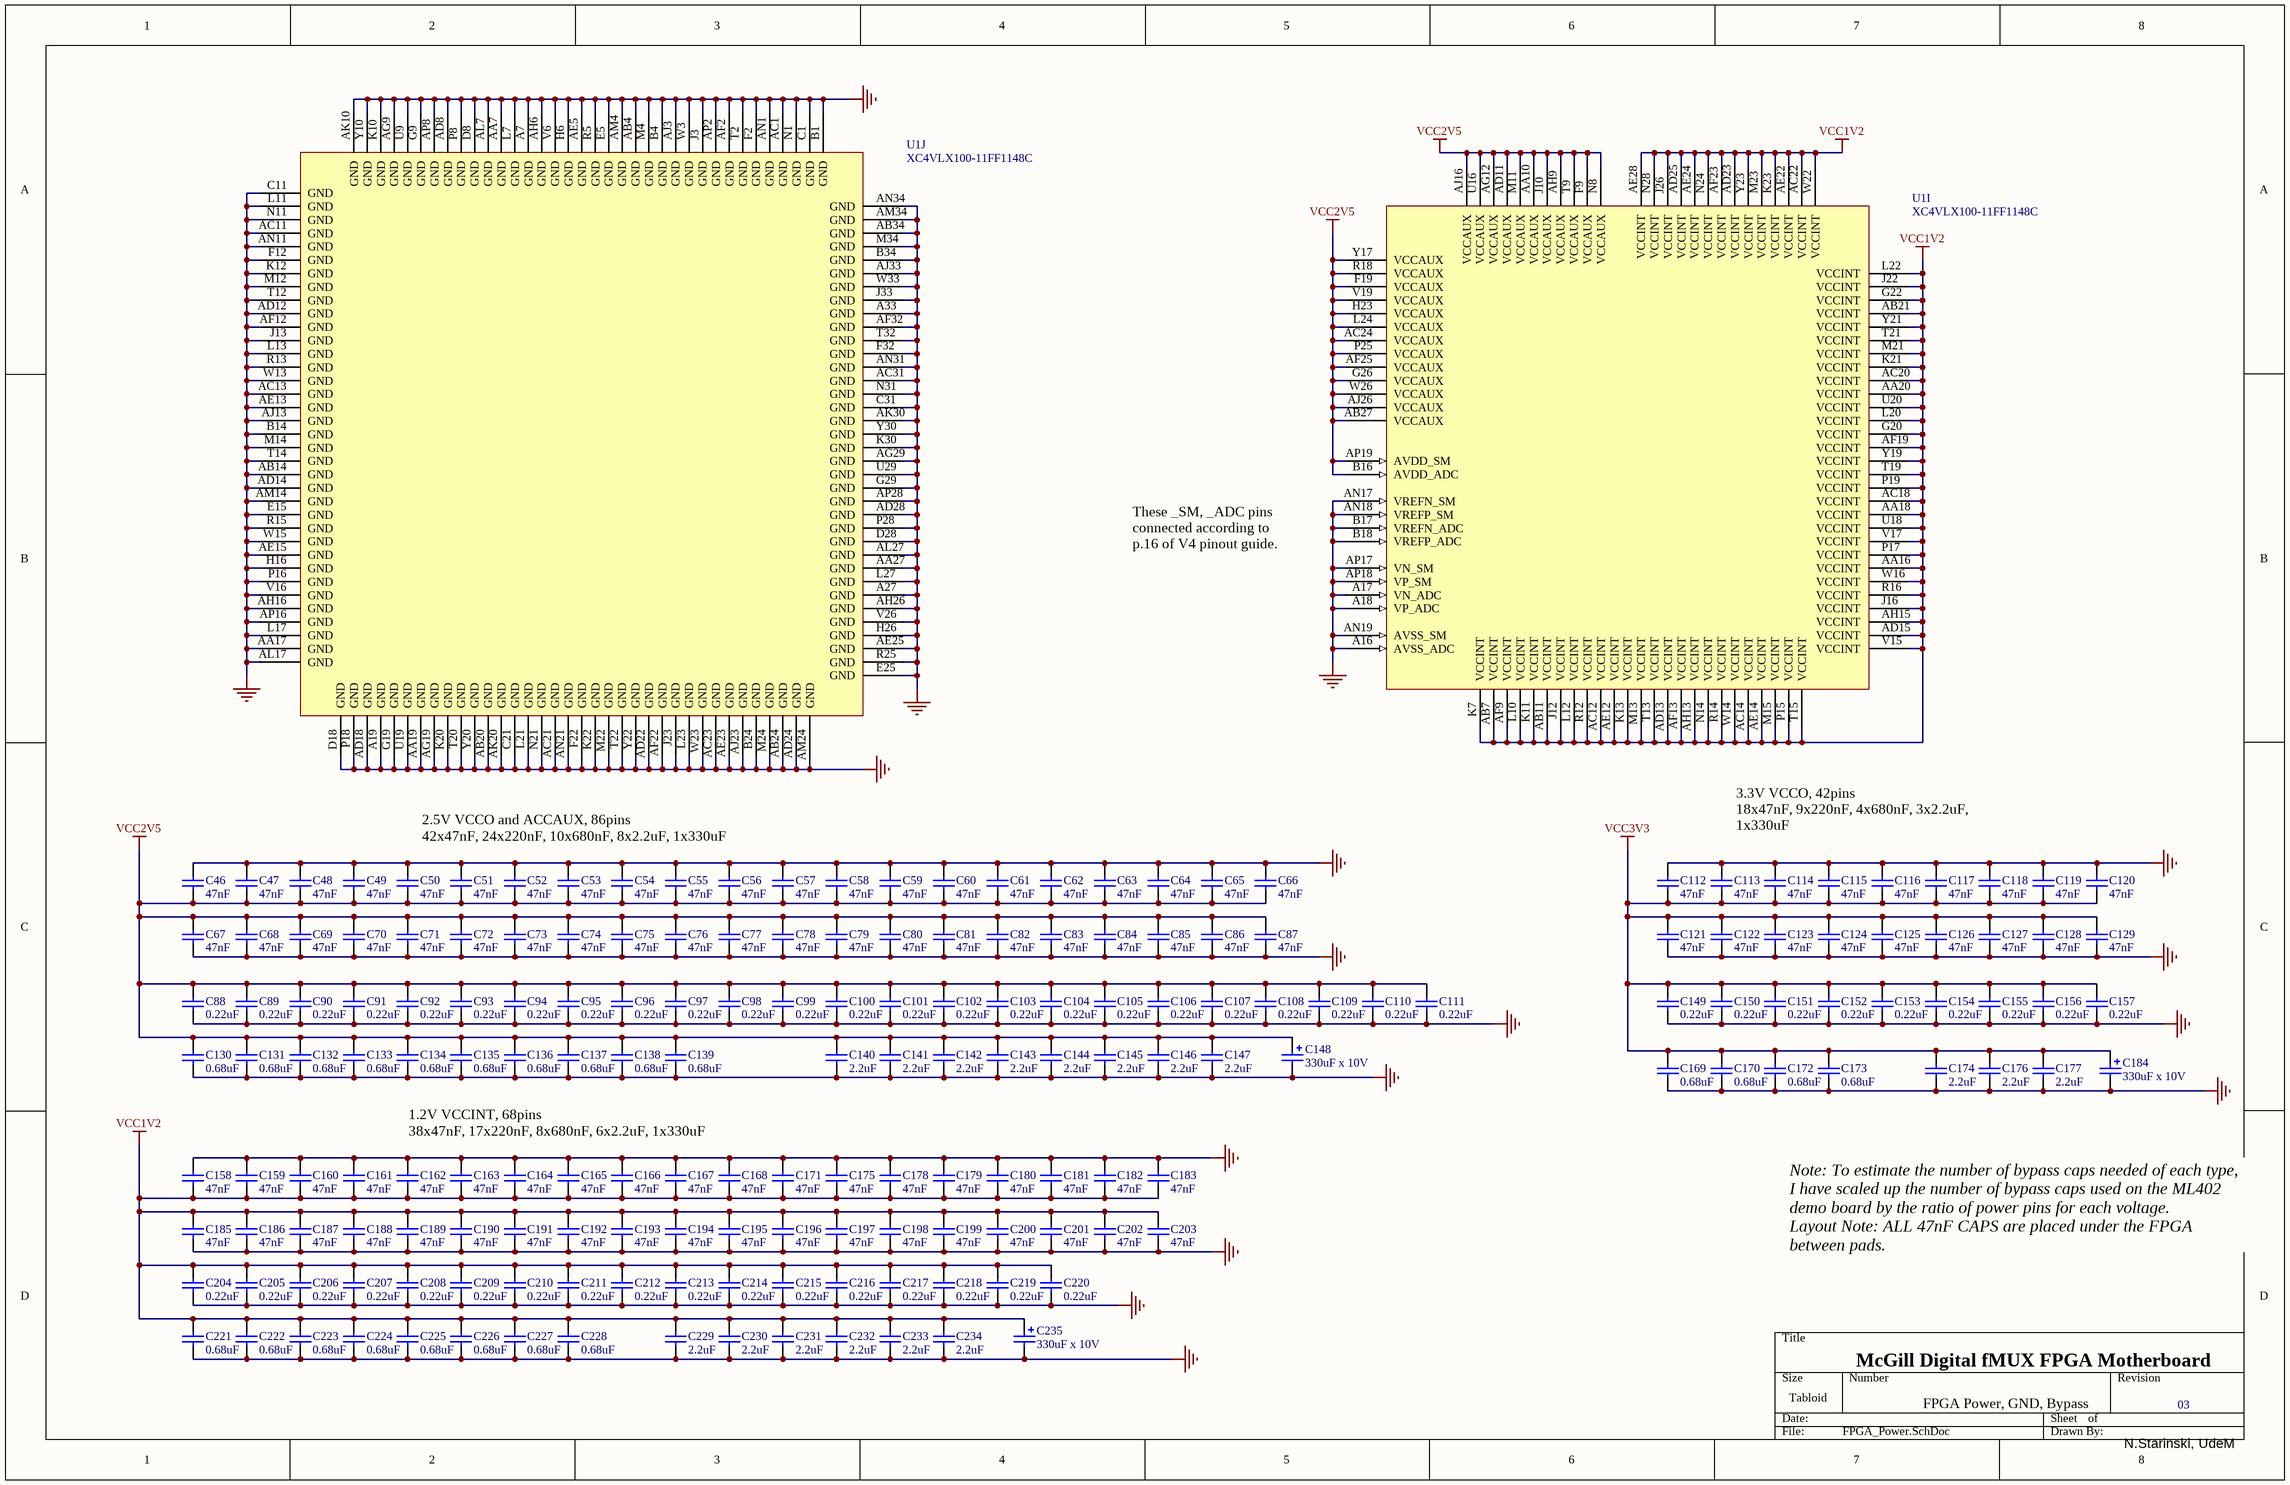
[diagram p17: FPGA_Power.SchDoc]

### Parts
C46  47nF  [CC1005-0402]
C47  47nF  [CC1005-0402]
C48  47nF  [CC1005-0402]
C49  47nF  [CC1005-0402]
C50  47nF  [CC1005-0402]
C51  47nF  [CC1005-0402]
C52  47nF  [CC1005-0402]
C53  47nF  [CC1005-0402]
C54  47nF  [CC1005-0402]
C55  47nF  [CC1005-0402]
C56  47nF  [CC1005-0402]
C57  47nF  [CC1005-0402]
C58  47nF  [CC1005-0402]
C59  47nF  [CC1005-0402]
C60  47nF  [CC1005-0402]
C61  47nF  [CC1005-0402]
C62  47nF  [CC1005-0402]
C63  47nF  [CC1005-0402]
C64  47nF  [CC1005-0402]
C65  47nF  [CC1005-0402]
C66  47nF  [CC1005-0402]
C67  47nF  [CC1005-0402]
C68  47nF  [CC1005-0402]
C69  47nF  [CC1005-0402]
C70  47nF  [CC1005-0402]
C71  47nF  [CC1005-0402]
C72  47nF  [CC1005-0402]
C73  47nF  [CC1005-0402]
C74  47nF  [CC1005-0402]
C75  47nF  [CC1005-0402]
C76  47nF  [CC1005-0402]
C77  47nF  [CC1005-0402]
C78  47nF  [CC1005-0402]
C79  47nF  [CC1005-0402]
C80  47nF  [CC1005-0402]
C81  47nF  [CC1005-0402]
C82  47nF  [CC1005-0402]
C83  47nF  [CC1005-0402]
C84  47nF  [CC1005-0402]
C85  47nF  [CC1005-0402]
C86  47nF  [CC1005-0402]
C87  47nF  [CC1005-0402]
C88  0.22uF  [CC1608-0603]
C89  0.22uF  [CC1608-0603]
C90  0.22uF  [CC1608-0603]
C91  0.22uF  [CC1608-0603]
C92  0.22uF  [CC1608-0603]
C93  0.22uF  [CC1608-0603]
C94  0.22uF  [CC1608-0603]
C95  0.22uF  [CC1608-0603]
C96  0.22uF  [CC1608-0603]
C97  0.22uF  [CC1608-0603]
C98  0.22uF  [CC1608-0603]
C99  0.22uF  [CC1608-0603]
C100  0.22uF  [CC1608-0603]
C101  0.22uF  [CC1608-0603]
C102  0.22uF  [CC1608-0603]
C103  0.22uF  [CC1608-0603]
C104  0.22uF  [CC1608-0603]
C105  0.22uF  [CC1608-0603]
C106  0.22uF  [CC1608-0603]
C107  0.22uF  [CC1608-0603]
C108  0.22uF  [CC1608-0603]
C109  0.22uF  [CC1608-0603]
C110  0.22uF  [CC1608-0603]
C111  0.22uF  [CC1608-0603]
C112  47nF  [CC1005-0402]
C113  47nF  [CC1005-0402]
C114  47nF  [CC1005-0402]
C115  47nF  [CC1005-0402]
C116  47nF  [CC1005-0402]
C117  47nF  [CC1005-0402]
C118  47nF  [CC1005-0402]
C119  47nF  [CC1005-0402]
C120  47nF  [CC1005-0402]
C121  47nF  [CC1005-0402]
C122  47nF  [CC1005-0402]
C123  47nF  [CC1005-0402]
C124  47nF  [CC1005-0402]
C125  47nF  [CC1005-0402]
C126  47nF  [CC1005-0402]
C127  47nF  [CC1005-0402]
C128  47nF  [CC1005-0402]
C129  47nF  [CC1005-0402]
C130  0.68uF  [CC3216-1206]
C131  0.68uF  [CC3216-1206]
C132  0.68uF  [CC3216-1206]
C133  0.68uF  [CC3216-1206]
C134  0.68uF  [CC3216-1206]
C135  0.68uF  [CC3216-1206]
C136  0.68uF  [CC3216-1206]
C137  0.68uF  [CC3216-1206]
C138  0.68uF  [CC3216-1206]
C139  0.68uF  [CC3216-1206]
C140  2.2uF  [CC3216-1206]
C141  2.2uF  [CC3216-1206]
C142  2.2uF  [CC3216-1206]
C143  2.2uF  [CC3216-1206]
C144  2.2uF  [CC3216-1206]
C145  2.2uF  [CC3216-1206]
C146  2.2uF  [CC3216-1206]
C147  2.2uF  [CC3216-1206]
C148  330uF x 10V  [CC7343-31_Dsize]
C149  0.22uF  [CC1608-0603]
C150  0.22uF  [CC1608-0603]
C151  0.22uF  [CC1608-0603]
C152  0.22uF  [CC1608-0603]
C153  0.22uF  [CC1608-0603]
C154  0.22uF  [CC1608-0603]
C155  0.22uF  [CC1608-0603]
C156  0.22uF  [CC1608-0603]
C157  0.22uF  [CC1608-0603]
C158  47nF  [CC1005-0402]
C159  47nF  [CC1005-0402]
C160  47nF  [CC1005-0402]
C161  47nF  [CC1005-0402]
C162  47nF  [CC1005-0402]
C163  47nF  [CC1005-0402]
C164  47nF  [CC1005-0402]
C165  47nF  [CC1005-0402]
C166  47nF  [CC1005-0402]
C167  47nF  [CC1005-0402]
C168  47nF  [CC1005-0402]
C169  0.68uF  [CC3216-1206]
C170  0.68uF  [CC3216-1206]
C171  47nF  [CC1005-0402]
C172  0.68uF  [CC3216-1206]
C173  0.68uF  [CC3216-1206]
C174  2.2uF  [CC3216-1206]
C175  47nF  [CC1005-0402]
C176  2.2uF  [CC3216-1206]
C177  2.2uF  [CC3216-1206]
C178  47nF  [CC1005-0402]
C179  47nF  [CC1005-0402]
C180  47nF  [CC1005-0402]
C181  47nF  [CC1005-0402]
C182  47nF  [CC1005-0402]
C183  47nF  [CC1005-0402]
C184  330uF x 10V  [CC7343-31_Dsize]
C185  47nF  [CC1005-0402]
C186  47nF  [CC1005-0402]
C187  47nF  [CC1005-0402]
C188  47nF  [CC1005-0402]
C189  47nF  [CC1005-0402]
C190  47nF  [CC1005-0402]
C191  47nF  [CC1005-0402]
C192  47nF  [CC1005-0402]
C193  47nF  [CC1005-0402]
C194  47nF  [CC1005-0402]
C195  47nF  [CC1005-0402]
C196  47nF  [CC1005-0402]
C197  47nF  [CC1005-0402]
C198  47nF  [CC1005-0402]
C199  47nF  [CC1005-0402]
C200  47nF  [CC1005-0402]
C201  47nF  [CC1005-0402]
C202  47nF  [CC1005-0402]
C203  47nF  [CC1005-0402]
C204  0.22uF  [CC1608-0603]
C205  0.22uF  [CC1608-0603]
C206  0.22uF  [CC1608-0603]
C207  0.22uF  [CC1608-0603]
C208  0.22uF  [CC1608-0603]
C209  0.22uF  [CC1608-0603]
C210  0.22uF  [CC1608-0603]
C211  0.22uF  [CC1608-0603]
C212  0.22uF  [CC1608-0603]
C213  0.22uF  [CC1608-0603]
C214  0.22uF  [CC1608-0603]
C215  0.22uF  [CC1608-0603]
C216  0.22uF  [CC1608-0603]
C217  0.22uF  [CC1608-0603]
C218  0.22uF  [CC1608-0603]
C219  0.22uF  [CC1608-0603]
C220  0.22uF  [CC1608-0603]
C221  0.68uF  [CC3216-1206]
C222  0.68uF  [CC3216-1206]
C223  0.68uF  [CC3216-1206]
C224  0.68uF  [CC3216-1206]
C225  0.68uF  [CC3216-1206]
C226  0.68uF  [CC3216-1206]
C227  0.68uF  [CC3216-1206]
C228  0.68uF  [CC3216-1206]
C229  2.2uF  [CC3216-1206]
C230  2.2uF  [CC3216-1206]
C231  2.2uF  [CC3216-1206]
C232  2.2uF  [CC3216-1206]
C233  2.2uF  [CC3216-1206]
C234  2.2uF  [CC3216-1206]
C235  330uF x 10V  [CC7343-31_Dsize]
U1  XC4VLX100-11FF1148C  [FF1148]  (parts I,J of 10)

### Nets
GND: C46.2 C47.2 C48.2 C49.2 C50.2 C51.2 C52.2 C53.2 C54.2 C55.2 C56.2 C57.2 C58.2 C59.2 C60.2 C61.2 C62.2 C63.2 C64.2 C65.2 C66.2 C67.1 C68.1 C69.1 C70.1 C71.1 C72.1 C73.1 C74.1 C75.1 C76.1 C77.1 C78.1 C79.1 C80.1 C81.1 C82.1 C83.1 C84.1 C85.1 C86.1 C87.1 C88.1 C89.1 C90.1 C91.1 C92.1 C93.1 C94.1 C95.1 C96.1 C97.1 C98.1 C99.1 C100.1 C101.1 C102.1 C103.1 C104.1 C105.1 C106.1 C107.1 C108.1 C109.1 C110.1 C111.1 C112.2 C113.2 C114.2 C115.2 C116.2 C117.2 C118.2 C119.2 C120.2 C121.1 C122.1 C123.1 C124.1 C125.1 C126.1 C127.1 C128.1 C129.1 C130.1 C131.1 C132.1 C133.1 C134.1 C135.1 C136.1 C137.1 C138.1 C139.1 C140.1 C141.1 C142.1 C143.1 C144.1 C145.1 C146.1 C147.1 C148.2 C149.1 C150.1 C151.1 C152.1 C153.1 C154.1 C155.1 C156.1 C157.1 C158.2 C159.2 C160.2 C161.2 C162.2 C163.2 C164.2 C165.2 C166.2 C167.2 C168.2 C169.1 C170.1 C171.2 C172.1 C173.1 C174.1 C175.2 C176.1 C177.1 C178.2 C179.2 C180.2 C181.2 C182.2 C183.2 C184.2 C185.1 C186.1 C187.1 C188.1 C189.1 C190.1 C191.1 C192.1 C193.1 C194.1 C195.1 C196.1 C197.1 C198.1 C199.1 C200.1 C201.1 C202.1 C203.1 C204.1 C205.1 C206.1 C207.1 C208.1 C209.1 C210.1 C211.1 C212.1 C213.1 C214.1 C215.1 C216.1 C217.1 C218.1 C219.1 C220.1 C221.1 C222.1 C223.1 C224.1 C225.1 C226.1 C227.1 C228.1 C229.1 C230.1 C231.1 C232.1 C233.1 C234.1 C235.2 U1.A7(GND) U1.A16(AVSS_ADC) U1.A17(VN_ADC) U1.A18(VP_ADC) U1.A19(GND) U1.A27(GND) U1.A33(GND) U1.AA7(GND) U1.AA17(GND) U1.AA19(GND) U1.AA27(GND) U1.AB4(GND) U1.AB14(GND) U1.AB20(GND) U1.AB24(GND) U1.AB34(GND) U1.AC1(GND) U1.AC11(GND) U1.AC13(GND) U1.AC21(GND) U1.AC23(GND) U1.AC31(GND) U1.AD8(GND) U1.AD12(GND) U1.AD14(GND) U1.AD18(GND) U1.AD22(GND) U1.AD24(GND) U1.AD28(GND) U1.AE5(GND) U1.AE13(GND) U1.AE15(GND) U1.AE23(GND) U1.AE25(GND) U1.AF2(GND) U1.AF12(GND) U1.AF22(GND) U1.AF32(GND) U1.AG9(GND) U1.AG19(GND) U1.AG29(GND) U1.AH6(GND) U1.AH16(GND) U1.AH26(GND) U1.AJ3(GND) U1.AJ13(GND) U1.AJ23(GND) U1.AJ33(GND) U1.AK10(GND) U1.AK20(GND) U1.AK30(GND) U1.AL7(GND) U1.AL17(GND) U1.AL27(GND) U1.AM4(GND) U1.AM14(GND) U1.AM24(GND) U1.AM34(GND) U1.AN1(GND) U1.AN11(GND) U1.AN17(VREFN_SM) U1.AN18(VREFP_SM) U1.AN19(AVSS_SM) U1.AN21(GND) U1.AN31(GND) U1.AN34(GND) U1.AP2(GND) U1.AP8(GND) U1.AP16(GND) U1.AP17(VN_SM) U1.AP18(VP_SM) U1.AP28(GND) U1.B1(GND) U1.B4(GND) U1.B14(GND) U1.B17(VREFN_ADC) U1.B18(VREFP_ADC) U1.B24(GND) U1.B34(GND) U1.C1(GND) U1.C11(GND) U1.C21(GND) U1.C31(GND) U1.D8(GND) U1.D18(GND) U1.D28(GND) U1.E5(GND) U1.E15(GND) U1.E25(GND) U1.F2(GND) U1.F12(GND) U1.F22(GND) U1.F32(GND) U1.G9(GND) U1.G19(GND) U1.G29(GND) U1.H6(GND) U1.H16(GND) U1.H26(GND) U1.J3(GND) U1.J13(GND) U1.J23(GND) U1.J33(GND) U1.K10(GND) U1.K12(GND) U1.K20(GND) U1.K22(GND) U1.K30(GND) U1.L7(GND) U1.L11(GND) U1.L13(GND) U1.L17(GND) U1.L21(GND) U1.L23(GND) U1.L27(GND) U1.M4(GND) U1.M12(GND) U1.M14(GND) U1.M22(GND) U1.M24(GND) U1.M34(GND) U1.N1(GND) U1.N11(GND) U1.N21(GND) U1.N31(GND) U1.P8(GND) U1.P16(GND) U1.P18(GND) U1.P28(GND) U1.R5(GND) U1.R13(GND) U1.R15(GND) U1.R25(GND) U1.T2(GND) U1.T12(GND) U1.T14(GND) U1.T20(GND) U1.T22(GND) U1.T32(GND) U1.U9(GND) U1.U19(GND) U1.U29(GND) U1.V6(GND) U1.V16(GND) U1.V26(GND) U1.W3(GND) U1.W13(GND) U1.W15(GND) U1.W23(GND) U1.W33(GND) U1.Y10(GND) U1.Y20(GND) U1.Y22(GND) U1.Y30(GND)
VCC1V2: C158.1 C159.1 C160.1 C161.1 C162.1 C163.1 C164.1 C165.1 C166.1 C167.1 C168.1 C171.1 C175.1 C178.1 C179.1 C180.1 C181.1 C182.1 C183.1 C185.2 C186.2 C187.2 C188.2 C189.2 C190.2 C191.2 C192.2 C193.2 C194.2 C195.2 C196.2 C197.2 C198.2 C199.2 C200.2 C201.2 C202.2 C203.2 C204.2 C205.2 C206.2 C207.2 C208.2 C209.2 C210.2 C211.2 C212.2 C213.2 C214.2 C215.2 C216.2 C217.2 C218.2 C219.2 C220.2 C221.2 C222.2 C223.2 C224.2 C225.2 C226.2 C227.2 C228.2 C229.2 C230.2 C231.2 C232.2 C233.2 C234.2 C235.1 U1.AA16(VCCINT) U1.AA18(VCCINT) U1.AA20(VCCINT) U1.AB7(VCCINT) U1.AB11(VCCINT) U1.AB21(VCCINT) U1.AC12(VCCINT) U1.AC14(VCCINT) U1.AC18(VCCINT) U1.AC20(VCCINT) U1.AC22(VCCINT) U1.AD13(VCCINT) U1.AD15(VCCINT) U1.AD23(VCCINT) U1.AD25(VCCINT) U1.AE12(VCCINT) U1.AE14(VCCINT) U1.AE22(VCCINT) U1.AE24(VCCINT) U1.AE28(VCCINT) U1.AF9(VCCINT) U1.AF13(VCCINT) U1.AF19(VCCINT) U1.AF23(VCCINT) U1.AH13(VCCINT) U1.AH15(VCCINT) U1.G20(VCCINT) U1.G22(VCCINT) U1.J12(VCCINT) U1.J16(VCCINT) U1.J22(VCCINT) U1.J26(VCCINT) U1.K7(VCCINT) U1.K11(VCCINT) U1.K13(VCCINT) U1.K21(VCCINT) U1.K23(VCCINT) U1.L10(VCCINT) U1.L12(VCCINT) U1.L20(VCCINT) U1.L22(VCCINT) U1.M13(VCCINT) U1.M15(VCCINT) U1.M21(VCCINT) U1.M23(VCCINT) U1.N14(VCCINT) U1.N24(VCCINT) U1.N28(VCCINT) U1.P15(VCCINT) U1.P17(VCCINT) U1.P19(VCCINT) U1.R12(VCCINT) U1.R14(VCCINT) U1.R16(VCCINT) U1.T13(VCCINT) U1.T15(VCCINT) U1.T19(VCCINT) U1.T21(VCCINT) U1.U18(VCCINT) U1.U20(VCCINT) U1.V15(VCCINT) U1.V17(VCCINT) U1.W14(VCCINT) U1.W16(VCCINT) U1.W22(VCCINT) U1.Y19(VCCINT) U1.Y21(VCCINT) U1.Y23(VCCINT)  [project net Vout3]
VCC2V5: C46.1 C47.1 C48.1 C49.1 C50.1 C51.1 C52.1 C53.1 C54.1 C55.1 C56.1 C57.1 C58.1 C59.1 C60.1 C61.1 C62.1 C63.1 C64.1 C65.1 C66.1 C67.2 C68.2 C69.2 C70.2 C71.2 C72.2 C73.2 C74.2 C75.2 C76.2 C77.2 C78.2 C79.2 C80.2 C81.2 C82.2 C83.2 C84.2 C85.2 C86.2 C87.2 C88.2 C89.2 C90.2 C91.2 C92.2 C93.2 C94.2 C95.2 C96.2 C97.2 C98.2 C99.2 C100.2 C101.2 C102.2 C103.2 C104.2 C105.2 C106.2 C107.2 C108.2 C109.2 C110.2 C111.2 C130.2 C131.2 C132.2 C133.2 C134.2 C135.2 C136.2 C137.2 C138.2 C139.2 C140.2 C141.2 C142.2 C143.2 C144.2 C145.2 C146.2 C147.2 C148.1 U1.AA10(VCCAUX) U1.AB27(VCCAUX) U1.AC24(VCCAUX) U1.AD11(VCCAUX) U1.AF25(VCCAUX) U1.AG12(VCCAUX) U1.AH9(VCCAUX) U1.AJ16(VCCAUX) U1.AJ26(VCCAUX) U1.AP19(AVDD_SM) U1.B16(AVDD_ADC) U1.F9(VCCAUX) U1.F19(VCCAUX) U1.G26(VCCAUX) U1.H23(VCCAUX) U1.J10(VCCAUX) U1.L24(VCCAUX) U1.M11(VCCAUX) U1.N8(VCCAUX) U1.P25(VCCAUX) U1.R18(VCCAUX) U1.T9(VCCAUX) U1.U16(VCCAUX) U1.V19(VCCAUX) U1.W26(VCCAUX) U1.Y17(VCCAUX)  [project net Vout2]
VCC3V3: C112.1 C113.1 C114.1 C115.1 C116.1 C117.1 C118.1 C119.1 C120.1 C121.2 C122.2 C123.2 C124.2 C125.2 C126.2 C127.2 C128.2 C129.2 C149.2 C150.2 C151.2 C152.2 C153.2 C154.2 C155.2 C156.2 C157.2 C169.2 C170.2 C172.2 C173.2 C174.2 C176.2 C177.2 C184.1

### Notes on the sheet
- These _SM, _ADC pins connected according to p.16 of V4 pinout guide.
- 3.3V VCCO, 42pins
  18x47nF, 9x220nF, 4x680nF, 3x2.2uF, 1x330uF
- 2.5V VCCO and ACCAUX, 86pins
  42x47nF, 24x220nF, 10x680nF, 8x2.2uF, 1x330uF
- 1.2V VCCINT, 68pins
  38x47nF, 17x220nF, 8x680nF, 6x2.2uF, 1x330uF
- Note: To estimate the number of bypass caps needed of each type, I have scaled up the number of bypass caps used on the ML402 demo board by the ratio of power pins for each voltage.
  Layout Note: ALL 47nF CAPS are placed under the FPGA between pads.
- McGill Digital fMUX FPGA Motherboard
- FPGA Power, GND, Bypass
- 03
- N.Starinski, UdeM

### Library data of the parts
C46-C147 C149-C183 C185-C234 = Cap Semi: Capacitor (Semiconductor SIM Model); Published: 8-Jun-2000; LatestRevisionDate: 17-Jul-2002; LatestRevisionNote: Re-released for DXP Platform.; PackageReference: C1206; Publisher: Altium Limited
C148 C184 C235 = Cap Pol3: CAP TANTD TPSD337K010R0100; Published: 8-Jun-2000; LatestRevisionDate: 17-Jul-2002; LatestRevisionNote: Re-released for DXP Platform.; PackageReference: C0805; Publisher: Altium Limited
U1 = XC4VLX100-11FF1148C: Xilinx Virtex-4 LX Platform FPGA, 1148-Ball FFBGA, Speed Grade 11, 768 User I/Os, Commercial Grade; PackageDocument: ver1.0, Oct-2002; Published: 13-Dec-2004; LatestRevisionDate: 4-Mar-2005; LatestRevisionNote: D_IN & CS_B pins changed from I/O to Input. DOUT_BUSY pin changed from I/O to Output.; DatasheetDocument: ver1.2, Dec-2004; PackageReference: FF1148; Publisher: Altium Limited; ComponentLink2Description: Virtex-4 Overview; ComponentLink2URL: http://www.xilinx.com/products/virtex4/overview.htm; ComponentLink3Description: Datasheet; ComponentLink3URL: http://direct.xilinx.com/bvdocs/userguides/ug075.pdf; Code_JEDEC: MS-034-AAR-1

## Sheet Housekeeping.SchDoc: FPGA Motherboard for Digital Multiplexed Readout, McGill U.
size A; DocumentNumber: DfMUX17; Revision: Rev0, Prototype; SheetNumber: 17; SheetTotal: 27; PageSetup: Record=PageOptions|CenterHorizontal=True|CenterVertical=True|PrintScale=1.05|XCorrection=1.00|YCorrection=1.00|PrintKind=0|BorderSize=5000000|LeftOffset=0|BottomOffset=0|Orientation=2|PaperLength=1000|PaperWidth=1000|Scale=100|PaperSource=7|PrintQuality=-4|MediaType=1|DitherType=10|PaperKind=Letter|PrintScaleMode=1
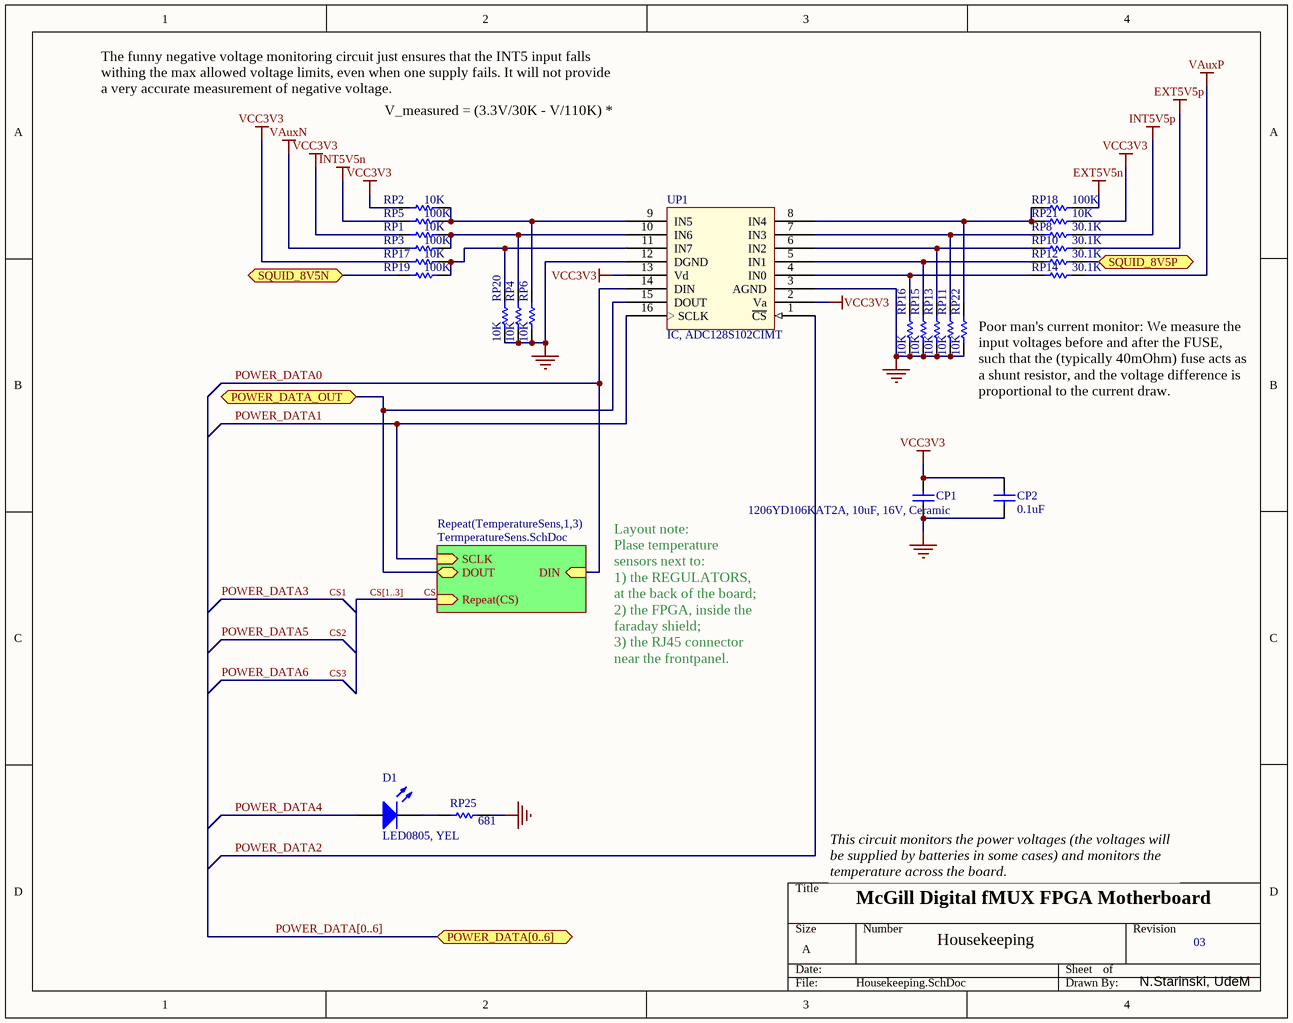
[diagram p18: Housekeeping.SchDoc]

### Parts
CP1  1206YD106KAT2A, 10uF, 16V, Ceramic  [CC3225-1210]
CP2  0.1uF  [CC1608-0603]
D1  LED0805, YEL  [SMD _LED]
RP1  10K  [CR1608-0603]
RP2  10K  [CR1608-0603]
RP3  100K  [CR1608-0603]
RP4  10K  [CR1608-0603]
RP5  100K  [CR1608-0603]
RP6  10K  [CR1608-0603]
RP8  30.1K  [CR1608-0603]
RP10  30.1K  [CR1608-0603]
RP11  10K  [CR1608-0603]
RP12  30.1K  [CR1608-0603]
RP13  10K  [CR1608-0603]
RP14  30.1K  [CR1608-0603]
RP15  10K  [CR1608-0603]
RP16  10K  [CR1608-0603]
RP17  10K  [CR1608-0603]
RP18  100K  [CR1608-0603]
RP19  100K  [CR1608-0603]
RP20  10K  [CR1608-0603]
RP21  10K  [CR1608-0603]
RP22  10K  [CR1608-0603]
RP25  681  [CR1608-0603]
UP1  IC, ADC128S102CIMT  [SSO-G16/X.45]

### Sub-sheets
Repeat(TemperatureSens,1,3) = TermperatureSens.SchDoc: SCLK (in), Repeat(CS) (in), DOUT (bidir), DIN (in)

### Ports
POWER_DATA[0..6], POWER_DATA_OUT (bidir), SQUID_8V5N, SQUID_8V5P

### Nets
EXT5V5n: RP18.2
EXT5V5p: RP10.2
GND: CP1.1 CP2.1 RP4.1 RP6.1 RP11.1 RP13.1 RP15.1 RP16.1 RP20.1 RP22.1 RP25.2 UP1.3(AGND) UP1.12(DGND)
INT5V5n: RP5.1
INT5V5p: RP8.2
VAuxN: RP3.1
VAuxP: RP14.2
VCC3V3: CP1.2 CP2.2 RP1.1 RP2.1 RP17.1 RP21.2 UP1.2(Va) UP1.13(Vd)
CS: sheet Repeat(TemperatureSens,1,3)/Repeat(CS)
POWER_DATA0: UP1.14(DIN) ; sheet Repeat(TemperatureSens,1,3)/DIN
POWER_DATA1: UP1.16(SCLK) ; sheet Repeat(TemperatureSens,1,3)/SCLK
POWER_DATA2: UP1.1(~{CS})
POWER_DATA4: D1.1(A)
POWER_DATA_OUT: UP1.15(DOUT) ; port POWER_DATA_OUT, sheet Repeat(TemperatureSens,1,3)/DOUT
SQUID_8V5N: RP19.1 ; port SQUID_8V5N
SQUID_8V5P: RP12.2 ; port SQUID_8V5P
NetD1_2: D1.2(K) RP25.1
NetRP1_2: RP1.2 RP3.2 RP4.2 UP1.10(IN6)
NetRP2_2: RP2.2 RP5.2 RP6.2 UP1.9(IN5)
NetRP8_1: RP8.1 RP11.2 UP1.7(IN3)
NetRP10_1: RP10.1 RP13.2 UP1.6(IN2)
NetRP12_1: RP12.1 RP15.2 UP1.5(IN1)
NetRP14_1: RP14.1 RP16.2 UP1.4(IN0)
NetRP17_2: RP17.2 RP19.2 RP20.2 UP1.11(IN7)
NetRP18_1: RP18.1 RP21.1 RP22.2 UP1.8(IN4)

### Buses and harness runs
bus CS[1..3]
bus POWER_DATA[0..6] = port POWER_DATA[0..6]

### Notes on the sheet
- The funny negative voltage monitoring circuit just ensures that the INT5 input falls withing the max allowed voltage limits, even when one supply fails. It will not provide a very accurate measurement of negative voltage.
- V_measured = (3.3V/30K - V/110K) * 10K
- (near RP22) Poor man's current monitor: We measure the input voltages before and after the FUSE, such that the (typically 40mOhm) fuse acts as a shunt resistor, and the voltage difference is proportional to the current draw.
- Layout note:
  Plase temperature sensors next to:
  1) the REGULATORS, at the back of the board;
  2) the FPGA, inside the faraday shield;
  3) the RJ45 connector near the frontpanel.
- This circuit monitors the power voltages (the voltages will be supplied by batteries in some cases) and monitors the temperature across the board.
- McGill Digital fMUX FPGA Motherboard
- Housekeeping
- 03
- N.Starinski, UdeM

### Library data of the parts
CP1 = Cap Semi: CAP POL 1206YD106KAT2A; Published: 8-Jun-2000; LatestRevisionDate: 17-Jul-2002; LatestRevisionNote: Re-released for DXP Platform.; PackageReference: C1206; Publisher: Altium Limited
CP2 = Cap Semi: Capacitor (Semiconductor SIM Model); Published: 8-Jun-2000; LatestRevisionDate: 17-Jul-2002; LatestRevisionNote: Re-released for DXP Platform.; PackageReference: C1206; Publisher: Altium Limited
D1 = LED3: LED 0805 LTST-C170YKT; Published: 8-Jun-2000; LatestRevisionDate: 17-Dec-2003; LatestRevisionNote: PCB Footprint replaced.; Publisher: Altium Limited
RP1 RP2 RP4 RP6 RP8 RP10-RP17 RP20-RP22 RP25 = Res Semi: Resistor 0603; Published: 8-Jun-2000; LatestRevisionDate: 17-Jul-2002; LatestRevisionNote: Re-released for DXP Platform.; Publisher: Altium Limited
RP3 RP5 RP18 RP19 = Res Semi: Semiconductor Resistor; Published: 8-Jun-2000; LatestRevisionDate: 17-Jul-2002; LatestRevisionNote: Re-released for DXP Platform.; Publisher: Altium Limited
UP1 = ADC128S102: 8-Channels, 500kSPS to 1 MSPS, 12-Bit ADC

## Sheet TermperatureSens.SchDoc: FPGA Motherboard for Digital Multiplexed Readout, McGill U.
size Letter; DocumentNumber: DfMUX18; Revision: Rev0, Prototype; SheetNumber: 18; SheetTotal: 27; PageSetup: Record=PageOptions|CenterHorizontal=True|CenterVertical=True|PrintScale=0.93|XCorrection=1.00|YCorrection=1.00|PrintKind=0|BorderSize=5000000|LeftOffset=0|BottomOffset=0|Orientation=2|PaperLength=1000|PaperWidth=1000|Scale=100|PaperSource=7|PrintQuality=-4|MediaType=1|DitherType=10|PaperKind=Letter|PrintScaleMode=1
Used 3 times, as channels U_Housekeeping/TemperatureSens1, U_Housekeeping/TemperatureSens2, U_Housekeeping/TemperatureSens3. Parts and nets are listed once, with the designators drawn on the sheet.
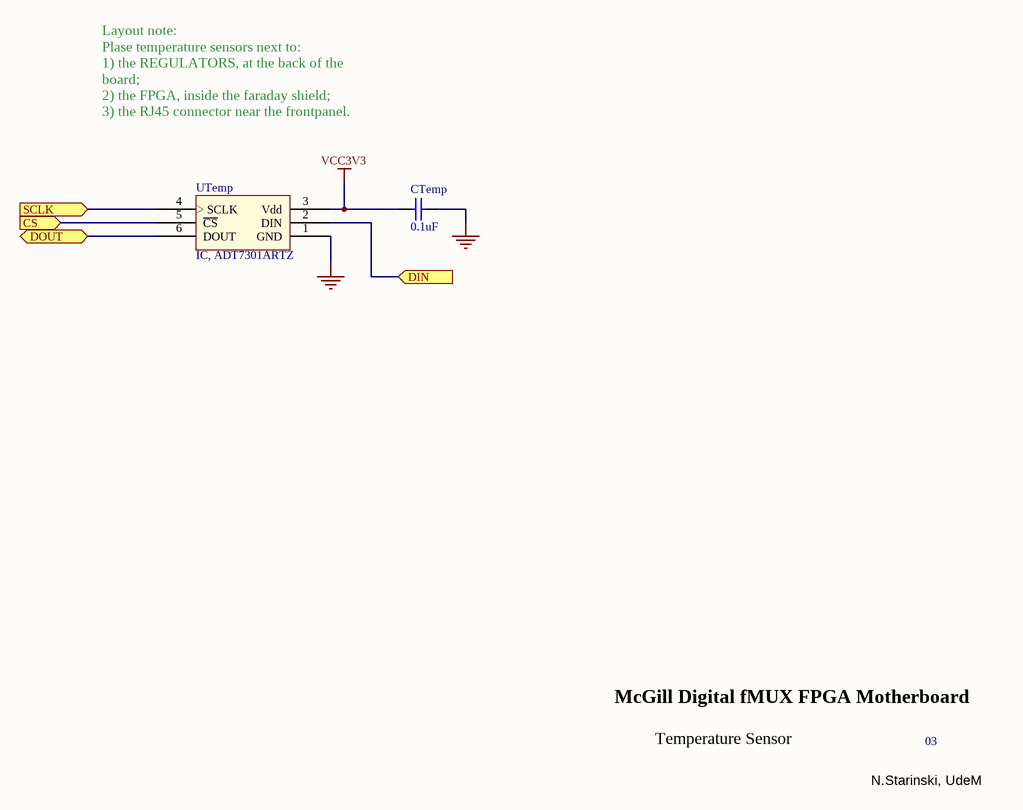
[diagram p19: TermperatureSens.SchDoc]

### Parts
CTemp  0.1uF  [CC1608-0603]
UTemp  IC, ADT7301ARTZ  [SO-G6/E2.4]

### Ports
CS (in), DIN (in), DOUT (bidir), SCLK (in)

### Nets
GND: CTemp.2 UTemp.1(GND)
VCC3V3: CTemp.1 UTemp.3(Vdd)
CS: UTemp.5(~{CS}) ; port CS
DIN: UTemp.2(DIN) ; port DIN
DOUT: UTemp.6(DOUT) ; port DOUT
SCLK: UTemp.4(SCLK) ; port SCLK

### Channels
U_Housekeeping/TemperatureSens1: designators end in _1; ports CS=CS1 DIN=POWER_DATA0 DOUT=POWER_DATA_OUT SCLK=POWER_DATA1
U_Housekeeping/TemperatureSens2: designators end in _2; ports CS=CS2 DIN=POWER_DATA0 DOUT=POWER_DATA_OUT SCLK=POWER_DATA1
U_Housekeeping/TemperatureSens3: designators end in _3; ports CS=CS3 DIN=POWER_DATA0 DOUT=POWER_DATA_OUT SCLK=POWER_DATA1

### Notes on the sheet
- Layout note:
  Plase temperature sensors next to:
  1) the REGULATORS, at the back of the board;
  2) the FPGA, inside the faraday shield;
  3) the RJ45 connector near the frontpanel.
- McGill Digital fMUX FPGA Motherboard
- Temperature Sensor
- 03
- N.Starinski, UdeM

### Library data of the parts
CTemp = Cap Semi: Capacitor (Semiconductor SIM Model); Published: 8-Jun-2000; LatestRevisionDate: 17-Jul-2002; LatestRevisionNote: Re-released for DXP Platform.; PackageReference: C1206; Publisher: Altium Limited
UTemp = ADT7301: Digital Temperature Sensor, 13-Bit, +/-1 Degree Accurate